# Altium project HW_ADHERENT_LANECTRL_R1.PrjPcb (part 1 of 2)
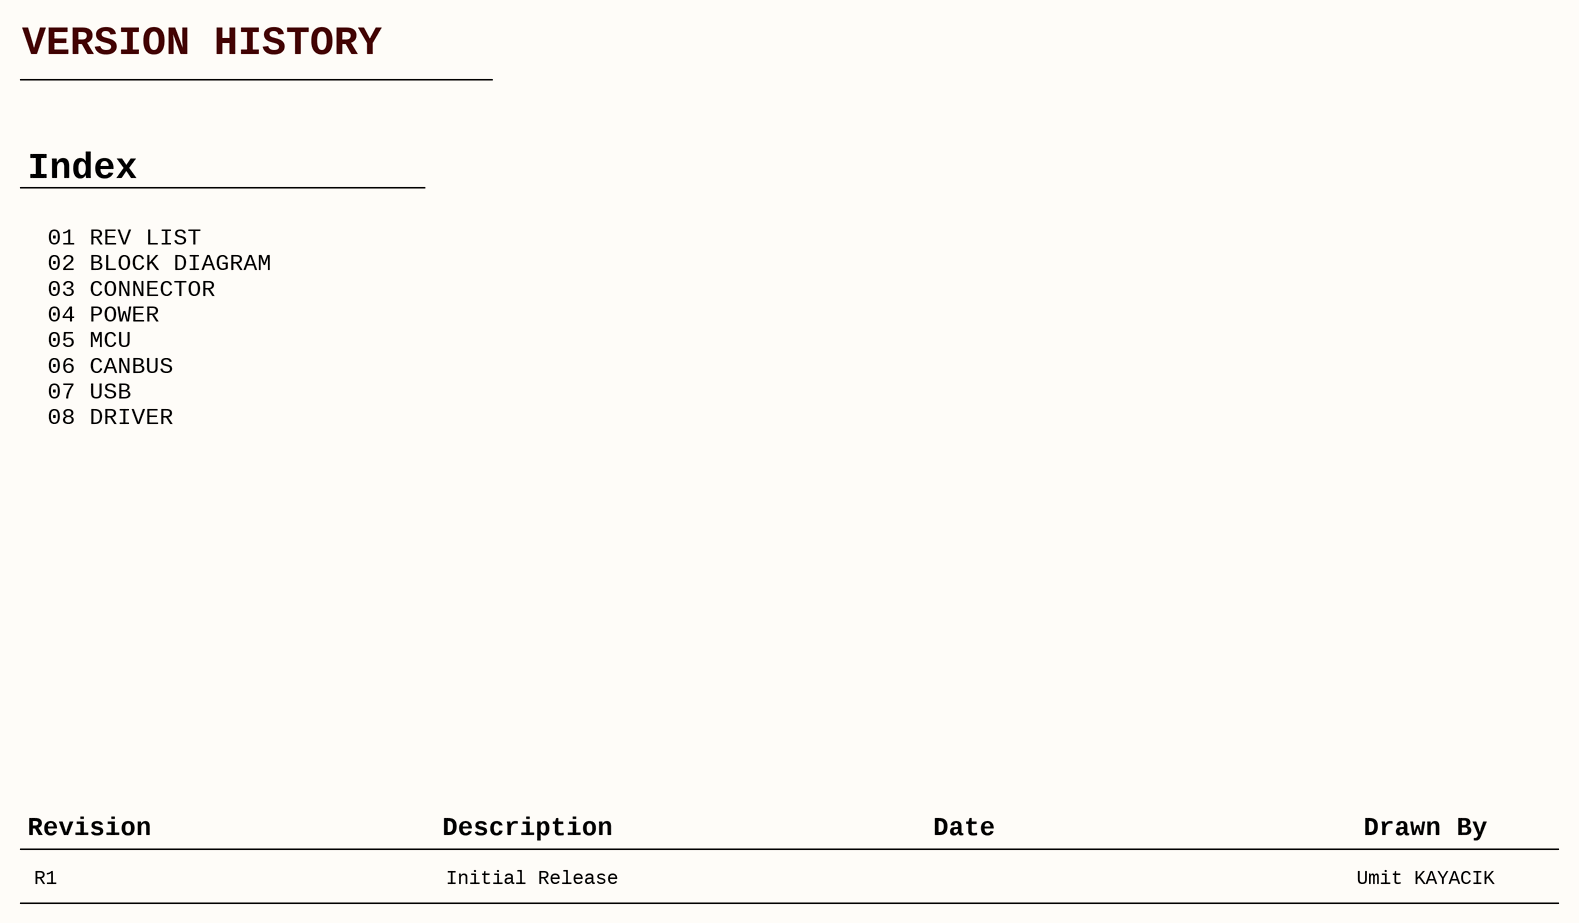
[diagram p0: 01_REVISION_HISTORY.SchDoc]
=Date: 23.09.2026; RevisionParameter: R1; TitleParameter: HW_ADHERENT_LANECTRL_R1
8 sheets, 223 parts. Net scope: flat (ports and power ports of the same name join across sheets).
Board file: HW_ADHERENT_LANECTRL_R1.PcbDoc
Sheets:
  01_REVISION_HISTORY.SchDoc
  02_BLOCK_DIAGRAM.SchDoc
  03_CONNECTOR.SchDoc
  04_POWER.SchDoc
  05_MCU.SchDoc
  06_CANBUS.SchDoc
  07_USB.SchDoc
  08_DRIVER.SchDoc

## Sheet 01_REVISION_HISTORY.SchDoc: =TitleParameter
size A3; Organization: ASISGUARD; Address1: Kemalpasa, Kemalpasa Cd. No:290 D:292H, 35060 Bornova/Izmir/Turkey; Revision: R1; SheetNumber: 1; SheetTotal: 8

### Notes on the sheet
- VERSION HISTORY
- Index
- 01 REV LIST
  02 BLOCK DIAGRAM
  03 CONNECTOR
  04 POWER
  05 MCU
  06 CANBUS
  07 USB
  08 DRIVER
- Revision
- Description
- Date
- Drawn By
- R1
- Initial Release
- Umit KAYACIK
- Proje/Project:
- Sayfa Adı/Document Name:
- Çizilme Tarihi/Drawing Date
- Tasarlayan/Designed By
- Sayfa/Sheet:
- Revision:
- of
- Son Güncelleme/Last Edit Date
- Kontrol eden/Checked By
- Onaylayan/Approved By
- Boyut/Size:
- Varyant/Variant:
- Dil/Language:
- A3
- ENG

## Sheet 02_BLOCK_DIAGRAM.SchDoc: =TitleParameter
size A3; Organization: ASISGUARD; Address1: Kemalpasa, Kemalpasa Cd. No:290 D:292H, 35060 Bornova/Izmir/Turkey; Revision: R1; SheetNumber: 2; SheetTotal: 8

### Notes on the sheet
- Proje/Project:
- Sayfa Adı/Document Name:
- Çizilme Tarihi/Drawing Date
- Umit KAYACIK
- Tasarlayan/Designed By
- Sayfa/Sheet:
- Revision:
- of
- Son Güncelleme/Last Edit Date
- Kontrol eden/Checked By
- Onaylayan/Approved By
- Boyut/Size:
- Varyant/Variant:
- Dil/Language:
- A3
- ENG
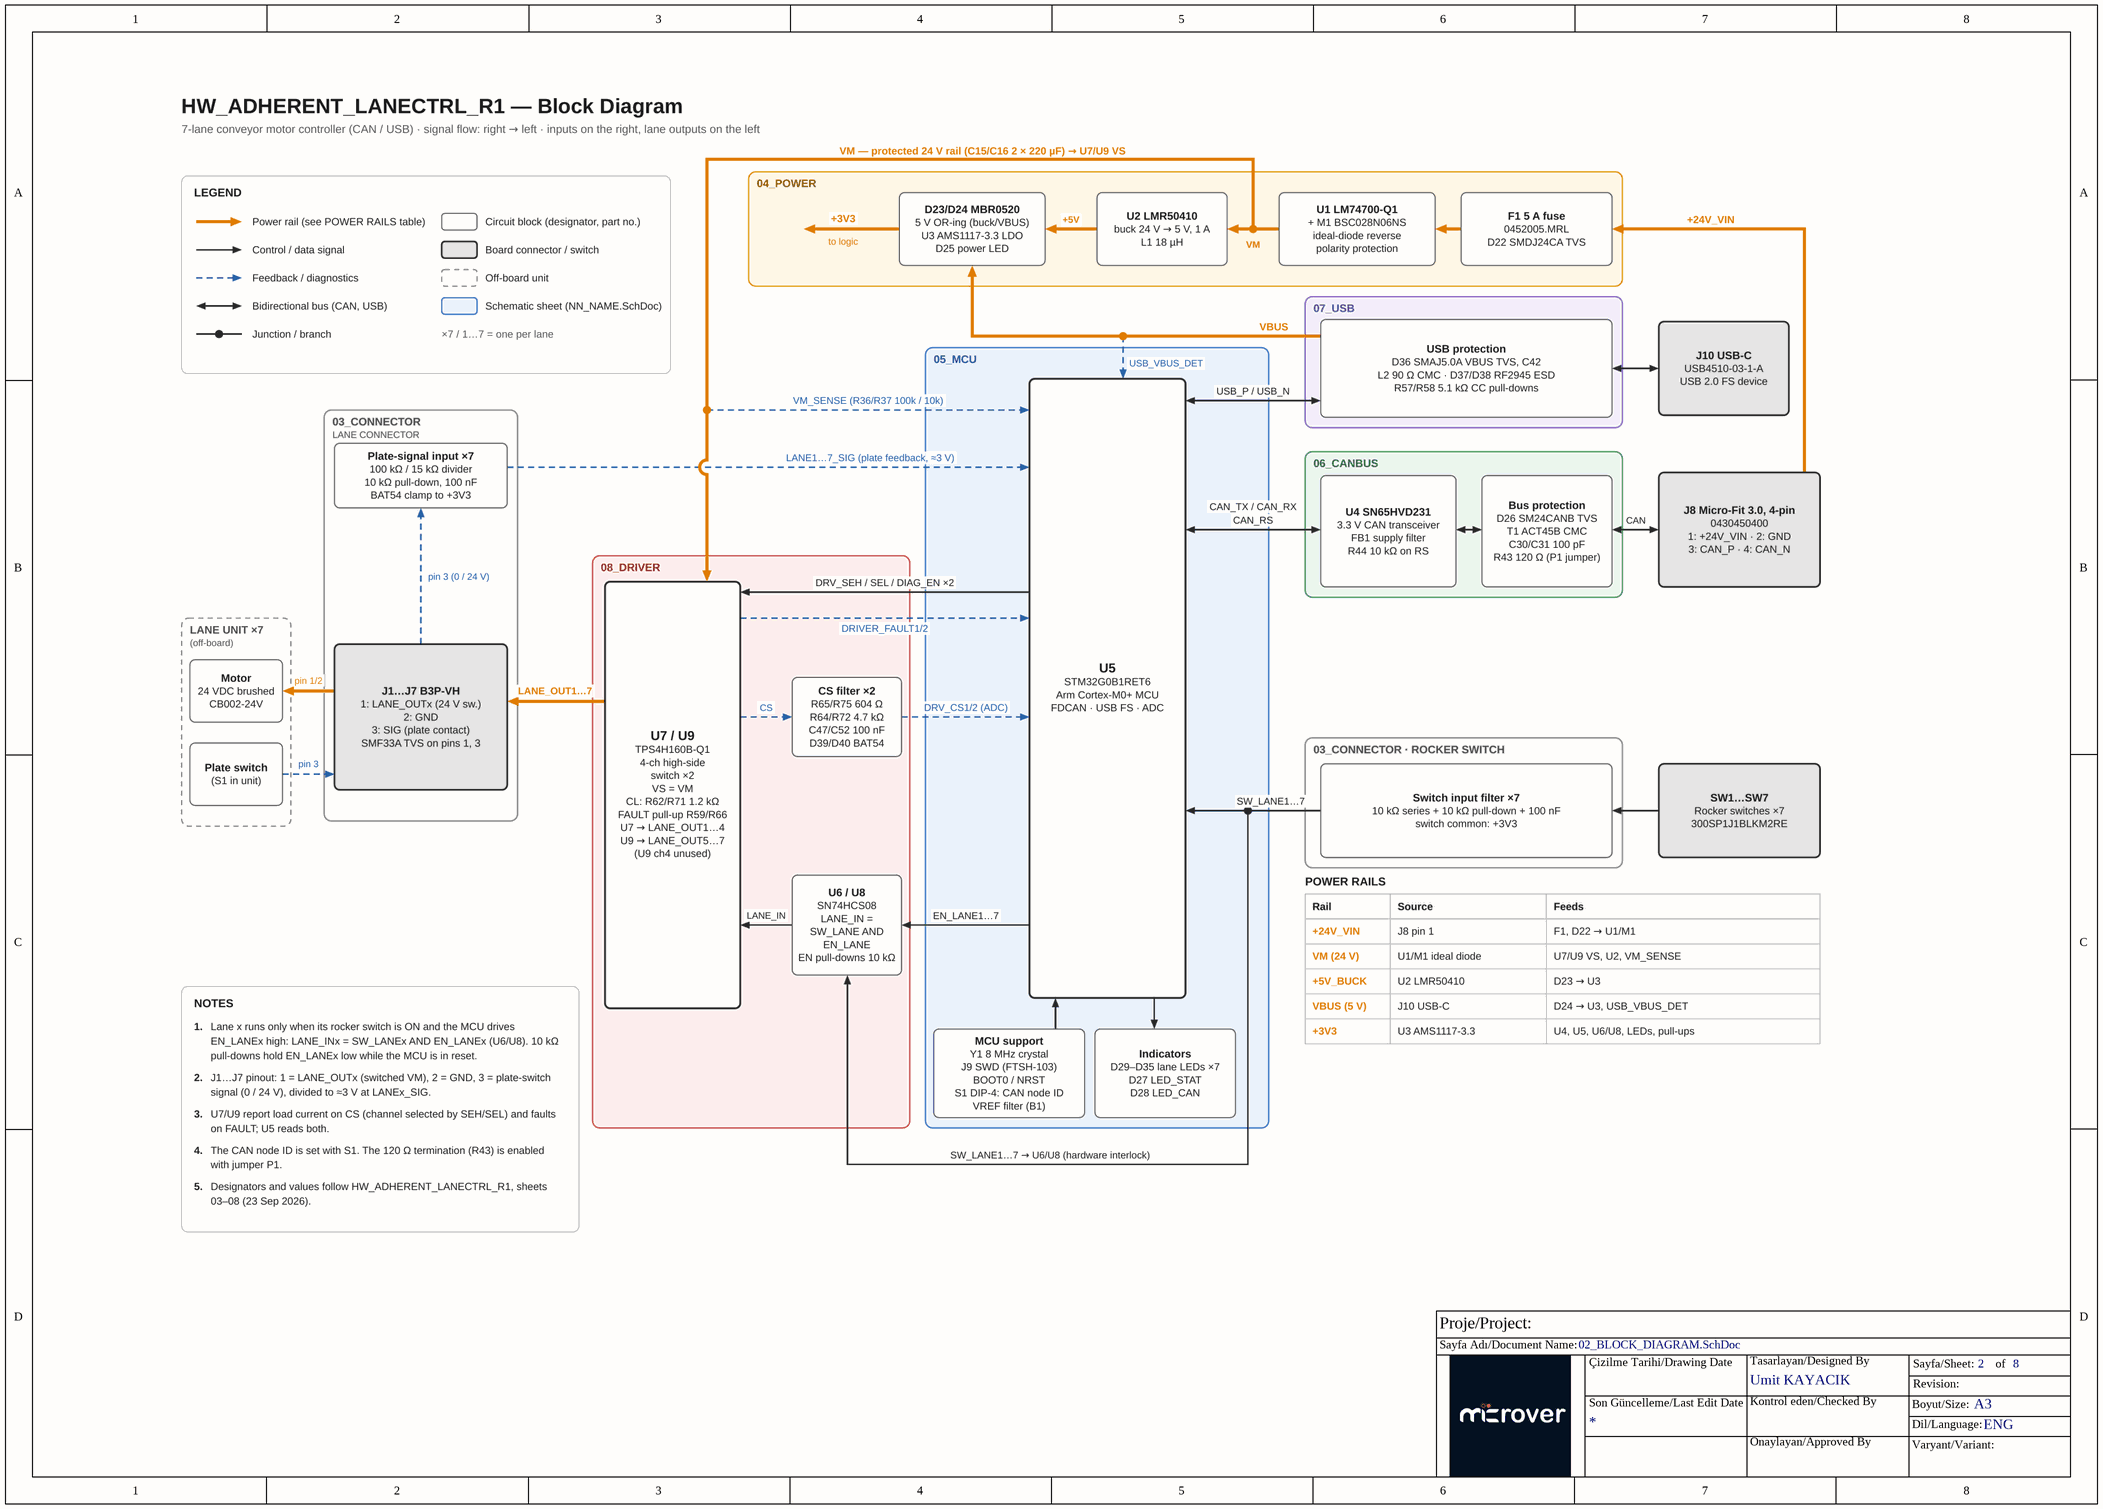
[diagram p1: 02_BLOCK_DIAGRAM.SchDoc]

## Sheet 03_CONNECTOR.SchDoc: =TitleParameter
size A3; Organization: ASISGUARD; Address1: Kemalpasa, Kemalpasa Cd. No:290 D:292H, 35060 Bornova/Izmir/Turkey; Revision: R1; SheetNumber: 3; SheetTotal: 8
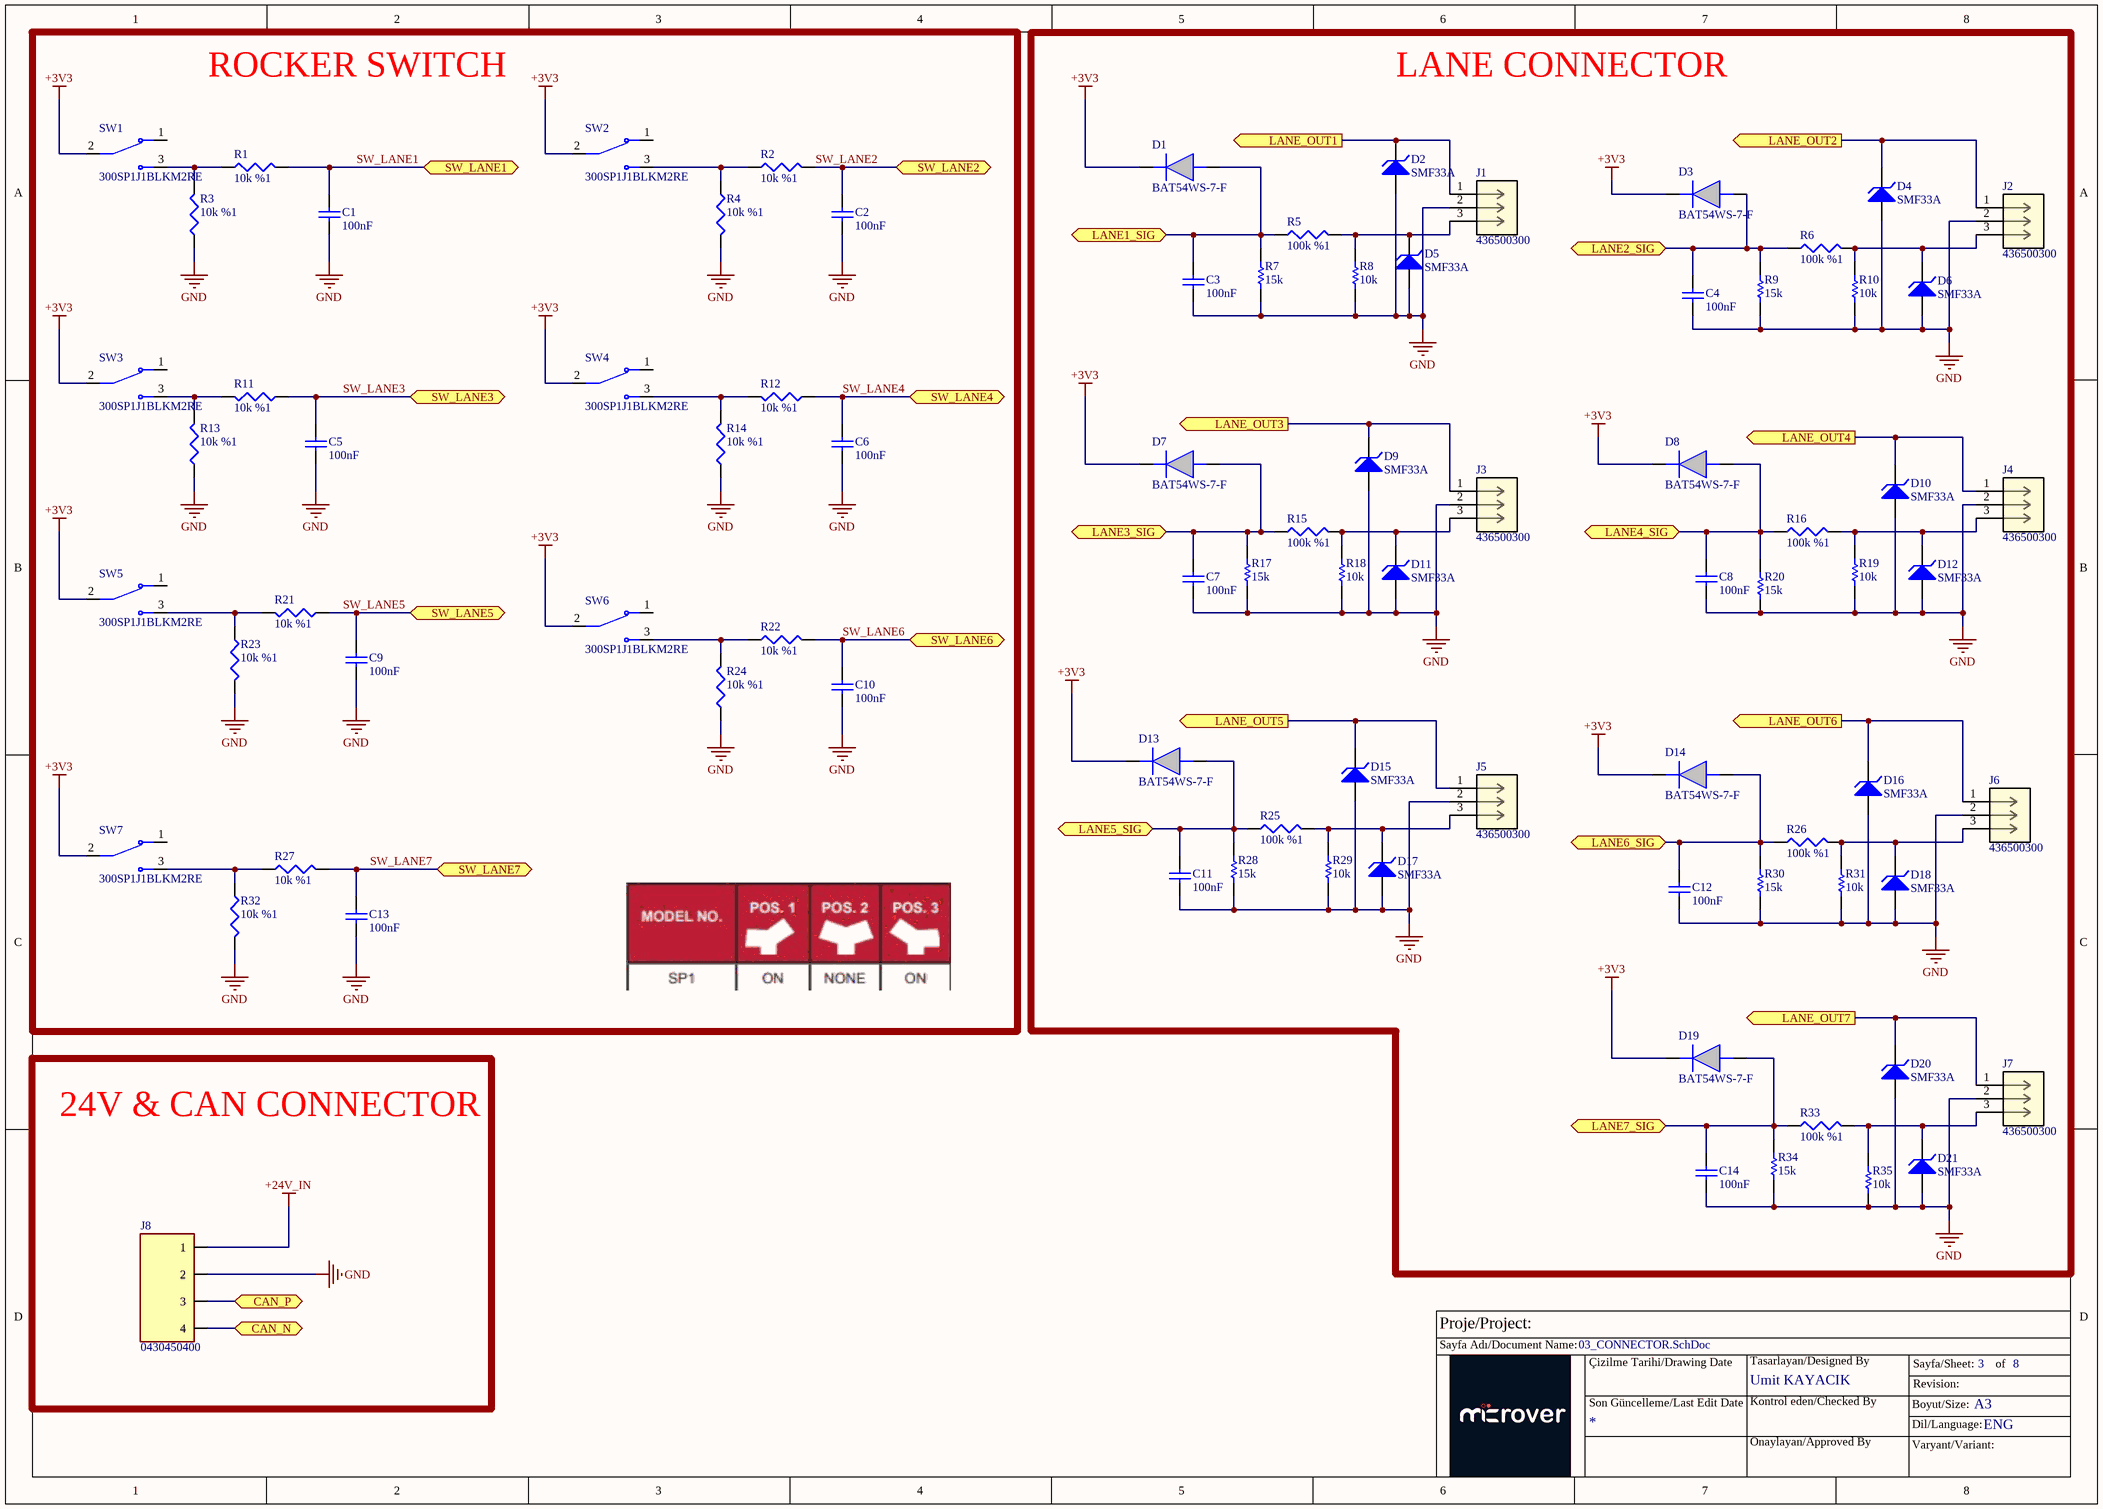
[diagram p2: 03_CONNECTOR.SchDoc]

### Parts
C1  100nF  [CAP0603]
C2  100nF  [CAP0603]
C3  100nF  [CAP0603]
C4  100nF  [CAP0603]
C5  100nF  [CAP0603]
C6  100nF  [CAP0603]
C7  100nF  [CAP0603]
C8  100nF  [CAP0603]
C9  100nF  [CAP0603]
C10  100nF  [CAP0603]
C11  100nF  [CAP0603]
C12  100nF  [CAP0603]
C13  100nF  [CAP0603]
C14  100nF  [CAP0603]
D1  BAT54WS-7-F  [SOD2513X120N]
D2  SMF33A  [SOD-123F - duplicate]
D3  BAT54WS-7-F  [SOD2513X120N]
D4  SMF33A  [SOD-123F - duplicate]
D5  SMF33A  [SOD-123F - duplicate]
D6  SMF33A  [SOD-123F - duplicate]
D7  BAT54WS-7-F  [SOD2513X120N]
D8  BAT54WS-7-F  [SOD2513X120N]
D9  SMF33A  [SOD-123F - duplicate]
D10  SMF33A  [SOD-123F - duplicate]
D11  SMF33A  [SOD-123F - duplicate]
D12  SMF33A  [SOD-123F - duplicate]
D13  BAT54WS-7-F  [SOD2513X120N]
D14  BAT54WS-7-F  [SOD2513X120N]
D15  SMF33A  [SOD-123F - duplicate]
D16  SMF33A  [SOD-123F - duplicate]
D17  SMF33A  [SOD-123F - duplicate]
D18  SMF33A  [SOD-123F - duplicate]
D19  BAT54WS-7-F  [SOD2513X120N]
D20  SMF33A  [SOD-123F - duplicate]
D21  SMF33A  [SOD-123F - duplicate]
J1  436500300  [CONN_SD-43650-001_03_MOL/]
J2  436500300  [CONN_SD-43650-001_03_MOL/]
J3  436500300  [CONN_SD-43650-001_03_MOL/]
J4  436500300  [CONN_SD-43650-001_03_MOL/]
J5  436500300  [CONN_SD-43650-001_03_MOL/]
J6  436500300  [CONN_SD-43650-001_03_MOL/]
J7  436500300  [CONN_SD-43650-001_03_MOL/]
J8  0430450400  [CONN_SD-43045-001_04_MOL]
R1  10k %1  [RESIS_0603]
R2  10k %1  [RESIS_0603]
R3  10k %1  [RESIS_0603]
R4  10k %1  [RESIS_0603]
R5  100k %1  [RESIS_0603]
R6  100k %1  [RESIS_0603]
R7  15k  [RESIS_0603]
R8  10k  [RES0805]
R9  15k  [RESIS_0603]
R10  10k  [RES0805]
R11  10k %1  [RESIS_0603]
R12  10k %1  [RESIS_0603]
R13  10k %1  [RESIS_0603]
R14  10k %1  [RESIS_0603]
R15  100k %1  [RESIS_0603]
R16  100k %1  [RESIS_0603]
R17  15k  [RESIS_0603]
R18  10k  [RES0805]
R19  10k  [RES0805]
R20  15k  [RESIS_0603]
R21  10k %1  [RESIS_0603]
R22  10k %1  [RESIS_0603]
R23  10k %1  [RESIS_0603]
R24  10k %1  [RESIS_0603]
R25  100k %1  [RESIS_0603]
R26  100k %1  [RESIS_0603]
R27  10k %1  [RESIS_0603]
R28  15k  [RESIS_0603]
R29  10k  [RES0805]
R30  15k  [RESIS_0603]
R31  10k  [RES0805]
R32  10k %1  [RESIS_0603]
R33  100k %1  [RESIS_0603]
R34  15k  [RESIS_0603]
R35  10k  [RES0805]
SW1  300SP1J1BLKM2RE  [sw_300SP1J1BLKM2RE_]
SW2  300SP1J1BLKM2RE  [sw_300SP1J1BLKM2RE_]
SW3  300SP1J1BLKM2RE  [sw_300SP1J1BLKM2RE_]
SW4  300SP1J1BLKM2RE  [sw_300SP1J1BLKM2RE_]
SW5  300SP1J1BLKM2RE  [sw_300SP1J1BLKM2RE_]
SW6  300SP1J1BLKM2RE  [sw_300SP1J1BLKM2RE_]
SW7  300SP1J1BLKM2RE  [sw_300SP1J1BLKM2RE_]

### Blocks framed on the sheet
ROCKER SWITCH: C1 C2 C5 C6 C9 C10 C13 R1-R4 R11-R14 R21-R24 R27 R32 SW1-SW7
LANE CONNECTOR: C3 C4 C7 C8 C11 C12 C14 D1-D21 J1-J7 R5-R10 R15-R20 R25 R26 R28-R31 R33-R35
24V & CAN CONNECTOR: J8

### Ports
CAN_N (bidir), CAN_P (bidir), LANE1_SIG (bidir), LANE2_SIG (bidir), LANE3_SIG (bidir), LANE4_SIG (bidir), LANE5_SIG (bidir), LANE6_SIG (bidir), LANE7_SIG (bidir), LANE_OUT1 (out), LANE_OUT2 (out), LANE_OUT3 (out), LANE_OUT4 (out), LANE_OUT5 (out), LANE_OUT6 (out), LANE_OUT7 (out), SW_LANE1 (bidir), SW_LANE2 (bidir), SW_LANE3 (bidir), SW_LANE4 (bidir), SW_LANE5 (bidir), SW_LANE6 (bidir), SW_LANE7 (bidir)

### Nets
+3V3: D1.1(K) D3.1(K) D7.1(K) D8.1(K) D13.1(K) D14.1(K) D19.1(K) SW1.2 SW2.2 SW3.2 SW4.2 SW5.2 SW6.2 SW7.2
+24V_IN: J8.1  [project net +24V_VIN]
GND: C1.1 C2.1 C3.1 C4.1 C5.1 C6.1 C7.1 C8.1 C9.1 C10.1 C11.1 C12.1 C13.1 C14.1 D2.2(A) D4.2(A) D5.2(A) D6.2(A) D9.2(A) D10.2(A) D11.2(A) D12.2(A) D15.2(A) D16.2(A) D17.2(A) D18.2(A) D20.2(A) D21.2(A) J1.2 J2.2 J3.2 J4.2 J5.2 J6.2 J7.2 J8.2 R3.1 R4.2 R7.1 R8.1 R9.1 R10.1 R13.1 R14.1 R17.1 R18.1 R19.1 R20.1 R23.2 R24.1 R28.1 R29.1 R30.1 R31.1 R32.2 R34.1 R35.1
CAN_N: J8.4 ; port CAN_N
CAN_P: J8.3 ; port CAN_P
LANE1_SIG: C3.2 D1.2(A) R5.1 R7.2 ; port LANE1_SIG
LANE2_SIG: C4.2 D3.2(A) R6.1 R9.2 ; port LANE2_SIG
LANE3_SIG: C7.2 D7.2(A) R15.1 R17.2 ; port LANE3_SIG
LANE4_SIG: C8.2 D8.2(A) R16.1 R20.2 ; port LANE4_SIG
LANE5_SIG: C11.2 D13.2(A) R25.1 R28.2 ; port LANE5_SIG
LANE6_SIG: C12.2 D14.2(A) R26.1 R30.2 ; port LANE6_SIG
LANE7_SIG: C14.2 D19.2(A) R33.1 R34.2 ; port LANE7_SIG
LANE_OUT1: D2.1(K) J1.1 ; port LANE_OUT1
LANE_OUT2: D4.1(K) J2.1 ; port LANE_OUT2
LANE_OUT3: D9.1(K) J3.1 ; port LANE_OUT3
LANE_OUT4: D10.1(K) J4.1 ; port LANE_OUT4
LANE_OUT5: D15.1(K) J5.1 ; port LANE_OUT5
LANE_OUT6: D16.1(K) J6.1 ; port LANE_OUT6
LANE_OUT7: D20.1(K) J7.1 ; port LANE_OUT7
SW_LANE1: C1.2 R1.2 ; port SW_LANE1
SW_LANE2: C2.2 R2.2 ; port SW_LANE2
SW_LANE3: C5.2 R11.1 ; port SW_LANE3
SW_LANE4: C6.2 R12.1 ; port SW_LANE4
SW_LANE5: C9.2 R21.1 ; port SW_LANE5
SW_LANE6: C10.2 R22.2 ; port SW_LANE6
SW_LANE7: C13.2 R27.2 ; port SW_LANE7
NetD5_1: D5.1(K) J1.3 R5.2 R8.2
NetD6_1: D6.1(K) J2.3 R6.2 R10.2
NetD11_1: D11.1(K) J3.3 R15.2 R18.2
NetD12_1: D12.1(K) J4.3 R16.2 R19.2
NetD17_1: D17.1(K) J5.3 R25.2 R29.2
NetD18_1: D18.1(K) J6.3 R26.2 R31.2
NetD21_1: D21.1(K) J7.3 R33.2 R35.2
NetR1_1: R1.1 R3.2 SW1.3
NetR2_1: R2.1 R4.1 SW2.3
NetR11_2: R11.2 R13.2 SW3.3
NetR12_2: R12.2 R14.2 SW4.3
NetR21_2: R21.2 R23.1 SW5.3
NetR22_1: R22.1 R24.2 SW6.3
NetR27_1: R27.1 R32.1 SW7.3

Not connected (* = marked no-connect by the designer): SW1 1; SW2 1; SW3 1; SW4 1; SW5 1; SW6 1; SW7 1

### Notes on the sheet
- Proje/Project:
- Sayfa Adı/Document Name:
- Çizilme Tarihi/Drawing Date
- Umit KAYACIK
- Tasarlayan/Designed By
- Sayfa/Sheet:
- Revision:
- of
- Son Güncelleme/Last Edit Date
- Kontrol eden/Checked By
- Onaylayan/Approved By
- Boyut/Size:
- Varyant/Variant:
- Dil/Language:
- A3
- ENG

### Library data of the parts
C1-C14 = CAP0603_100nF_50V: 0.1 µF ±10% 50V Ceramic Capacitor X7R 0603 (1608 Metric); Manufacturer Name: KEMET; Manufacturer Part Number: C0603C104K5RAC7867; Datasheet Link: https://componentsearchengine.com/Datasheets/1/06031A100FAT2A.pdf; Height: 0.9mm
D1 D3 D7 D8 D13 D14 D19 = BAT54WS-7-F: Diode 30 V 100mA Surface Mount SOD-323; MPN: BAT54WS-7-F; Supplier: C124205
D2 D4-D6 D9-D12 D15-D18 D20 D21 = SMF33A: 53.3V Clamp 3.8A Ipp Tvs Diode Surface Mount SOD-123F; Manufacturer: Littelfuse Inc.; MPN: SMF33A
J1-J7 = 436500300: Micro-Fit 3.0 Right-Angle Header, 3.00mm Pitch, Single Row, 3 Circuits, with Snap-in Plastic Peg PCB Lock, Tin, Glow-Wire Capable, Black; Manufacturer Part Number: 436500300; Supplier: Digi; WM1861-ND
J8 = 0430450400: Connector Header Through Hole, Right Angle 4 position 0.118" (3.00mm); Manufacturer: MOLEX; Manufacturer Part Number: 0430450400; Supplier: Digi; WM1814-ND
R1-R4 R11-R14 R21-R24 R27 R32 = 0603WAF1002T5E: Thick Film Resistors - SMD 0603 100 mW (1/10 W) 1% 10K; Manufacturer: UNI-ROYAL(Uniroyal Elec); Supplier_JLCPCB: C25804; Supplier_MOUSER: 303-0603WAF1002T5E
R5 R6 R15 R16 R25 R26 R33 = 0603WAF1003T5E: -55℃~+155℃ 100kΩ 100mW 75V Thick Film Resistor ±1% ±100ppm/℃ 0603 Chip Resistor - Surface Mount ROHS; Manufacturer: UNI-ROYAL(Uniroyal Elec); Supplier_JLCPCB: C25803; Supplier_MOUSER: 303-0603WAF1003T5E
R7 R9 R17 R20 R28 R30 R34 = 0603WAF1502T5E: -55℃~+155℃ 100mW 15kΩ 75V Thick Film Resistor ±1% ±100ppm/℃ 0603 Chip Resistor - Surface Mount ROHS; Manufacturer: UNI-ROYAL(Uniroyal Elec); JLCPCB PART 3: C22809; Mouser Part Number: 303-0603WAF1502T5E
R8 R10 R18 R19 R29 R31 R35 = 0805W8F1002T5E: -55℃~+155℃ 10kΩ 125mW 150V Thick Film Resistor ±1% ±100ppm/℃ 0805 Chip Resistor - Surface Mount ROHS; Manufacturer: UNI-ROYAL(Uniroyal Elec); JLCPCB PART#: C17414
SW1-SW7 = 300SP1J1BLKM2RE: Rocker Switch SPDT 0.4VA (AC/DC) 20 V Through Hole; Manufacturer: E-Switch; MPN: 300SP1J1BLKM2RE; Supplier: Dıgı; EG4312-ND

## Sheet 04_POWER.SchDoc: =TitleParameter
size A3; Project: HW_RYP_RADAR_R3; Organization: ASISGUARD; Address1: Kemalpasa, Kemalpasa Cd. No:290 D:292H, 35060 Bornova/Izmir/Turkey; Revision: R1; SheetNumber: 4; SheetTotal: 8
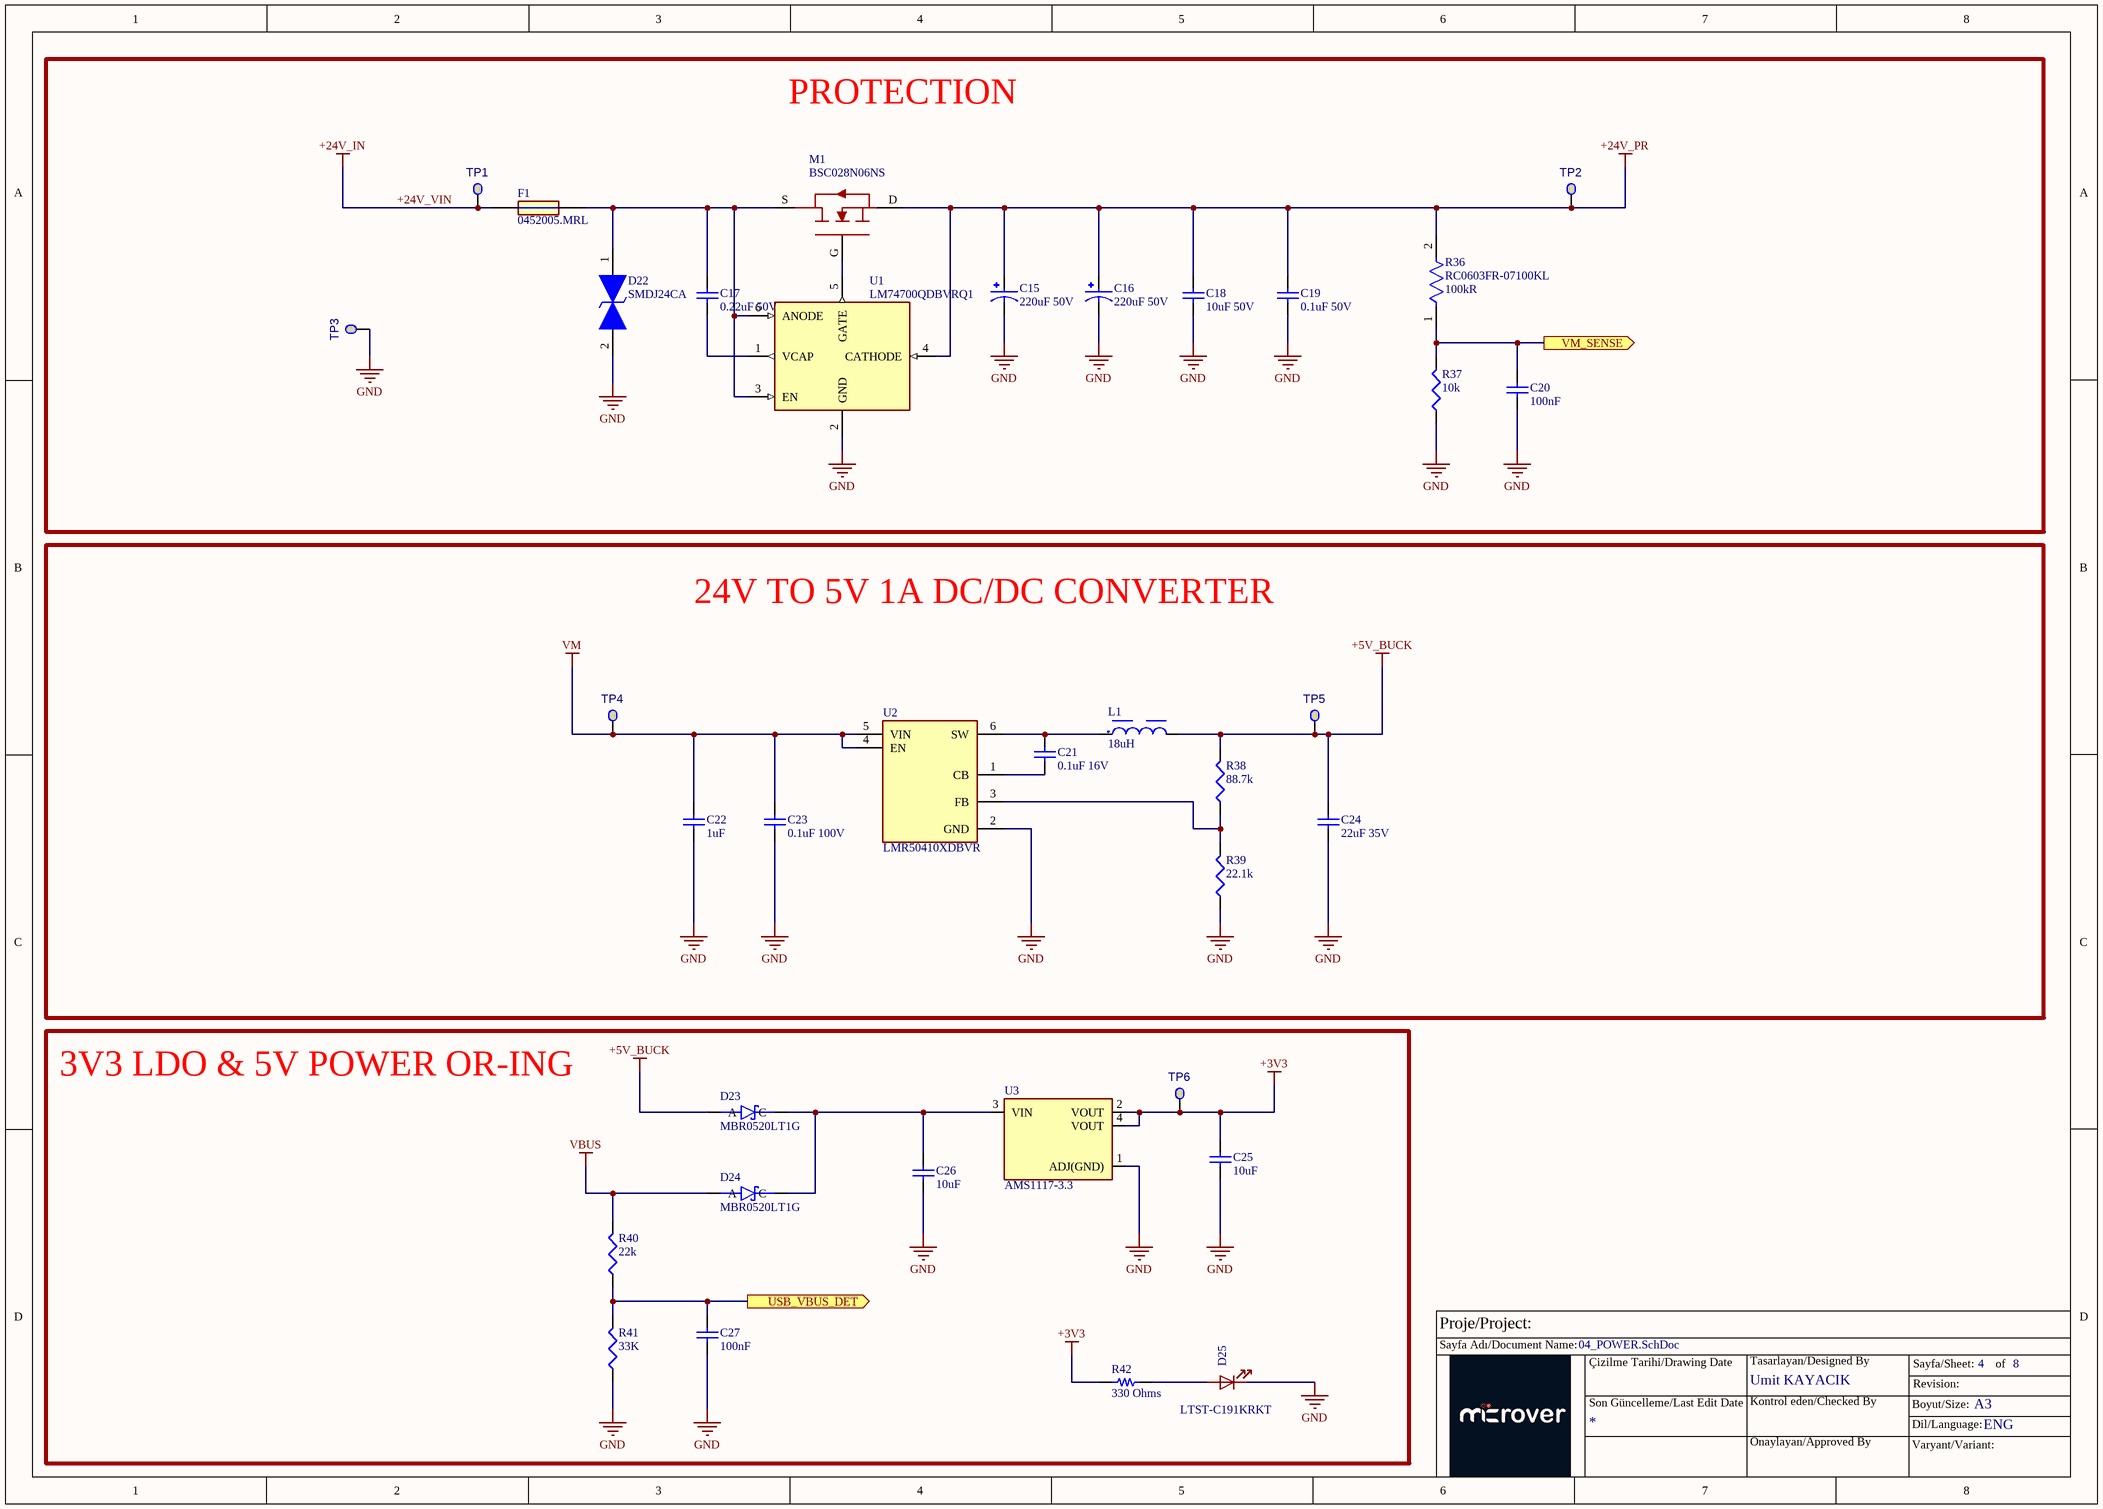
[diagram p3: 04_POWER.SchDoc]

### Parts
C15  220uF 50V  [CAP_EEEFT1H221AV]
C16  220uF 50V  [CAP_EEEFT1H221AV]
C17  value 0.22uF 50V  [SMC0603]  (hidden comment: CAP CER 0.22UF 50V X7R 0603)
C18  value 10uF 50V  [SMC1206]  (hidden comment: CAP CER 10UF 50V X5R 1206)
C19  value 0.1uF 50V  [SMC0603]  (hidden comment: CAP CER 0.1UF 50V X7R 0603)
C20  value 100nF  [CAP0603]  (hidden comment: 100nF 25V)
C21  0.1uF 16V  [CAP0603]
C22  1uF  [CAP0603]
C23  0.1uF 100V  [CAP0603]
C24  22uF 35V  [CAP1206]
C25  10uF  [CAP0603]
C26  10uF  [CAP0603]
C27  value 100nF  [CAP0603]  (hidden comment: 100nF 25V)
D22  SMDJ24CA  [DIONM9059X262N]
D23  MBR0520LT1G  [SOD3716X135N]
D24  MBR0520LT1G  [SOD3716X135N]
D25  LTST-C191KRKT  [LED0603]
F1  0452005.MRL  [FUSC6127X294N]
L1  18uH  [WE-LQS_6045]
M1  BSC028N06NS  [BSC028N06NS]
R36  RC0603FR-07100KL  Resistance: 100kR  [FP-RC0603-0_55-MFG]
R37  value 10k  [RES0603]  (hidden comment: RES 10K OHM 1% 1/8W 0603)
R38  88.7k  [RES0603]
R39  22.1k  [RES0603]
R40  value 22k  [SMR0603]  (hidden comment: RES 22K OHM 1% 1/10W 0603)
R41  value 33K  [SMR0603]  (hidden comment: RES 33K OHM 1% 1/10W 0603)
R42  330 Ohms  [RES 0603_1608]
TP1  Testpoint  [SMD_Ø1.5mm]  (value not drawn)  (no BOM)
TP2  Testpoint  [SMD_Ø1.5mm]  (value not drawn)  (no BOM)
TP3  Testpoint  [SMD_Ø1.5mm]  (value not drawn)  (no BOM)
TP4  Testpoint  [SMD_Ø1.5mm]  (value not drawn)  (no BOM)
TP5  Testpoint  [SMD_Ø1.5mm]  (value not drawn)  (no BOM)
TP6  Testpoint  [SMD_Ø1.5mm]  (value not drawn)  (no BOM)
U1  LM74700QDBVRQ1  [SOT95P280X145-6N/LM74700QDBVRQ1]
U2  LMR50410XDBVR  [SOT95P280X145-6N/]
U3  AMS1117-3.3  [SOT-223-4_L6.5-W3.5-P2.30-LS7.0-BR]

### Blocks framed on the sheet
PROTECTION: C15-C20 D22 F1 M1 R36 R37 TP1-TP3 U1
24V TO 5V 1A DC/DC CONVERTER: C21-C24 L1 R38 R39 TP4 TP5 U2
3V3 LDO & 5V POWER OR-ING: C25-C27 D23-D25 R40-R42 TP6 U3

### Ports
USB_VBUS_DET (out), VM_SENSE (out)

### Nets
+3V3: C25.2 R42.1 TP6.1(P1) U3.2(VOUT) U3.4(VOUT)
+5V_BUCK: C24.2 D23.A L1.2 R38.2 TP5.1(P1)
+24V_PR: C15.1 C16.1 C18.2 C19.2 M1.D R36.2 TP2.1(P1) U1.4(CATHODE)
+24V_VIN: F1.1 TP1.1(P1)  [also labelled +24V_IN]
GND: C15.2 C16.2 C18.1 C19.1 C20.1 C22.1 C23.1 C24.1 C25.1 C26.1 C27.1 D22.2 D25.2(K) R37.1 R39.1 R41.1 TP3.1(P1) U1.2(GND) U2.2(GND) U3.1(ADJ(GND))
VBUS: D24.A R40.2
VM: C22.2 C23.2 TP4.1(P1) U2.4(EN) U2.5(VIN)
USB_VBUS_DET: C27.2 R40.1 R41.2 ; port USB_VBUS_DET
VM_SENSE: C20.2 R36.1 R37.2 ; port VM_SENSE
NetC17_1: C17.1 U1.1(VCAP)
NetC17_2: C17.2 D22.1 F1.2 M1.S U1.3(EN) U1.6(ANODE)
NetC21_1: C21.1 U2.1(CB)
NetC21_2: C21.2 L1.1 U2.6(SW)
NetC26_2: C26.2 D23.C D24.C U3.3(VIN)
NetD25_1: D25.1(A) R42.2
NetM1_G: M1.G U1.5(GATE)
NetR38_1: R38.1 R39.2 U2.3(FB)

### Notes on the sheet
- Proje/Project:
- Sayfa Adı/Document Name:
- Çizilme Tarihi/Drawing Date
- Umit KAYACIK
- Tasarlayan/Designed By
- Sayfa/Sheet:
- Revision:
- of
- Son Güncelleme/Last Edit Date
- Kontrol eden/Checked By
- Onaylayan/Approved By
- Boyut/Size:
- Varyant/Variant:
- Dil/Language:
- A3
- ENG

### Library data of the parts
C15 C16 = EEEFT1H221AV: 220 µF 50 V Aluminum Electrolytic Capacitors Radial, Can - SMD 180mOhm @ 100kHz 2000 Hrs @ 105°C; Manufacturer Part Number: EEE-FT1H221AV; MF: Panasonic Electronic Components; Package: RADIAL-2 Panasonic; Price: None; Availability: In Stock; Value: *; Check_prices: https://www.snapeda.com/parts/EEE-FT1H221AV/Panasonic/view-part/5517810/?ref=eda; SnapEDA_Link: https://www.snapeda.com/parts/EEE-FT1H221AV/Panasonic/view-part/5517810/?ref=snap
C17 = CAP0603_0.22UF_50V: 0.22 µF ±10% 50V Ceramic Capacitor X7R 0603 (1608 Metric); Manufacturer Part Number: GCM188R71H224KA64D; Order Code: DIGI: 490-5402-2-ND
C18 = CAP1206_10UF_50V: 10 µF ±10% 50V Ceramic Capacitor X5R 1206 (3216 Metric); Manufacturer Part Number: CL31A106KBHNNNE; Order Code: Digi: 1276-2876-2-ND; Sirius Stock Code: *; LCSC Part Number: C13585; LCSC Manufacturer Part Number: CL31A106KBHNNNE
C19 = CAP0603_0.1UF_50V_2: 0.1 µF ±10% 50V Ceramic Capacitor X7R 0603 (1608 Metric); Manufacturer Part Number: CL10B104KB8NNNL; LCSC Manufacturer Part Number: CL10B104KB8NNNC; Order Code: DIGI:1276-CL10B104KB8NNNLTR-ND; Sirius Stock Code: A063-AGC10300001226; LCSC Part Number: C1591
C20 C27 = CAP0603_100nF: 0.1 µF ±10% 50V Ceramic Capacitor X7R 0603 (1608 Metric); Manufacturer Part Number: CL10B104KA8NNNC; LCSC Part Number: C1590
C21 = C0603C104M4RACTU: 0.1 µF ±20% 16V Ceramic Capacitor X7R 0603 (1608 Metric); Manifacturer: KEMET; Supplier: Digi; 399-C0603C104M4RACTUDKR-ND
C22 = MSASU168SB5105MTNA01: CAP CER 1UF 50V X5R 0603; Manufacturer: Taiyo Yuden; Supplier: 587-MSASU168SB5105MTNA01DKR-ND
C23 = GRM188R72A104KA35D: CAP CER 0.1UF 100V X7R 0603; Manifacturer: Murata Electronics; Supplier: Digi; 490-3285-6-ND
C24 = CAP1206_22uF_35V: 22 µF ±20% 35V Ceramic Capacitor X5R 1206 (3216 Metric); Manufacturer Part Number: C3216X5R1V226M160AC; Order Code: DIGI : 445-180362-1-ND; Value: 22uF 35V
C25 C26 = CAP0603_10uF_25V: 10 µF ±10% 25V Ceramic Capacitor X5R 0603 (1608 Metric); Manufacturer Part Number: GRM188R61E106KA73J; Order Code: Digi; 490-GRM188R61E106KA73JDKR-ND; Value: 10uF
D22 = SMDJ24CA: 38.9V Clamp 77.1A Ipp Tvs Diode Surface Mount DO-214AB (SMCJ); Manufacturer: Littelfuse Inc.; MPN: SMDJ24CA
D23 D24 = MBR0520LT1G: Diode 20 V 500mA Surface Mount SOD-123
D25 = LED_1: LED RED CLEAR SMD; Manufacturer: Lite-On Inc.; Value: LTST-C191KRKT; Footprint: LED_SMD:LED_0603_1608Metric; Manufacturer Part Number: LTST-C191KRKT; Supplier Part Number: 160-1447-1-ND
F1 = 0452005.MRL: FUSE BRD MNT 5A 125VAC/VDC 2SMD; Manufacturer: Littelfuse; Supplier: Digi; F2607DKR-ND
L1 = 74404064180: 18 µH Semi-Shielded Drum Core, Wirewound Inductor 2.2 A 81mOhm Nonstandard; Supplier: 732-5553-6-ND
M1 = BSC028N06NS: MOSFET'ler N-Ch 60V 100A TDSON-8 OptiMOS 3
R36 = CMP-2100-03662-2: RES SMD 100K OHM 1% 1/10W 0603; Voltage Rating (DC): 50V; Max Power Dissipation: 100mW; Temperature Coefficient: 100ppm/°C; Working Voltage: 75V; Length: 1.6mm; Lead Free: Lead Free; Number of Terminations: 2; Packaging: Tape and Reel; Voltage Rating: 50V; Termination: SMD/SMT; Width: 0.8mm; Resistor Type: Thick Film; Resistance Tolerance: 1%; Features: Moisture Resistant; Height: 0.45mm; Construction: Rectangular; Case/Package: 0603; Military Standard: Not; Case Code (Imperial): 0603; Series: RC; Technology: THICK FILM; Depth: 0.8mm; RoHS Compliant: Yes; REACH SVHC: No SVHC; Min Operating Temperature: -55°C; Case Code (Metric): 1608; Max Operating Temperature: 155°C; Power Rating: 100mW; Number of Pins: 2; Tolerance: 1%
R37 = RES0603_10K_%1_1: 10 kOhms ±1% 0.125W, 1/8W Chip Resistor 0603 (1608 Metric) Anti-Sulfur Thin Film; Manufacturer Part Number: RNCP0603FTD10K0; LCSC Manufacturer Part Number: MCT06030C1002FP500; Order Code: Digi: RNCP0603FTD10K0TR-ND; Sirius Stock Code: *; LCSC Part Number: C161803
R38 = CRCW060388K7FKEA: 88.7 kOhms ±1% 0.125W, 1/8W Chip Resistor 0603 (1608 Metric) Automotive AEC-Q200 Thick Film
R39 = RC0603FR-0722K1L: 22.1 kOhms ±1% 0.1W, 1/10W Chip Resistor 0603 (1608 Metric) Moisture Resistant Thick Film
R40 = RES0603_22K_%1: 10 kOhms ±1% 0.1W, 1/10W Chip Resistor 0603 (1608 Metric) Moisture Resistant Thick Film; Manufacturer Part Number: RC0603FR-0722KL; Order Code: Digi: 311-22.0KHRTR-ND; Sirius Stock Code: *; LCSC Part Number: C114065; LCSC Manufacturer Part Number: RC0603FR-0722KL
R41 = RES0603_33K_%1: 33 kOhms ±1% 0.1W, 1/10W Chip Resistor 0603 (1608 Metric) Moisture Resistant Thick Film; Manufacturer Part Number: RC0603FR-0733KL; Order Code: Digi: 311-33.0KHRTR-ND; Sirius Stock Code: *; LCSC Manufacturer Part Number: RC0603FR-0733KL; LCSC Part Number: C126359
R42 = CRGH0603F330R: RES SMD 330 OHM 1% 1/5W 0603; Manufacturer: TE Connectivity Passive Product; Power (Watts): 0.2W, 1/5W; Temperature Coefficient: ±100ppm/°C; Part Number: CRGH0603F330R; Value: 330 Ohms; ComponentLink1Description: Datasheet; ComponentLink1URL: https://www.te.com/commerce/DocumentDelivery/DDEController?Action=srchrtrv&DocNm=1773204-1&DocType=DS&DocLang=English; ComponentLink2Description: DigiKey Link; ComponentLink2URL: https://www.digikey.com/en/products/detail/te-connectivity-passive-product/CRGH0603F330R/5586961; Composition: Thick Film; Device Package: 0603 (1608 Metric); Height - Seated (Max): 0.022" (0.55mm); LastUpdated: 2/9/2024 8:43:33 PM; Lifecycle Status: Active; Minimum Order: 1; Number of Terminations: 2; Operating Temperature: -55°C ~ 155°C; Package / Case: 0603 (1608 Metric); Packaging: TapeAndReel; PartId: 5733; Part Status: Active; Price: 0.01; Resistance: 330 Ohms; Series: CRGH, Neohm; Size / Dimension: 0.063" L x 0.031" W (1.60mm x 0.80mm); Supplier 1: DigiKey; Supplier Part Number 1: A129541CT-ND; Supplier Device Package: 0603; Tolerance: ±1%
TP1-TP6 = TEST PAD SMT 10MIL X 20MIL: DNP: DNP; Value: Testpoint
U1 = LM74700QDBVRQ1: OR Controller N+1 ORing Controller N-Channel 1:1 SOT-23-6
U2 = LMR50410XDBVR: Buck Switching Regulator IC Positive Adjustable 1V 1 Output 1A SOT-23-6; Supplier: 296-LMR50410XDBVRDKR-ND; MPN: LMR50410XDBVR
U3 = AMS1117-3.3: Linear Voltage Regulator IC Positive Fixed 1 Output 1A SOT-223-3L; Manufacturer: UMW; Supplier: C347222

## Sheet 05_MCU.SchDoc: =TitleParameter
size A3; Organization: ASISGUARD; Address1: Kemalpasa, Kemalpasa Cd. No:290 D:292H, 35060 Bornova/Izmir/Turkey; Revision: R1; SheetNumber: 5; SheetTotal: 8
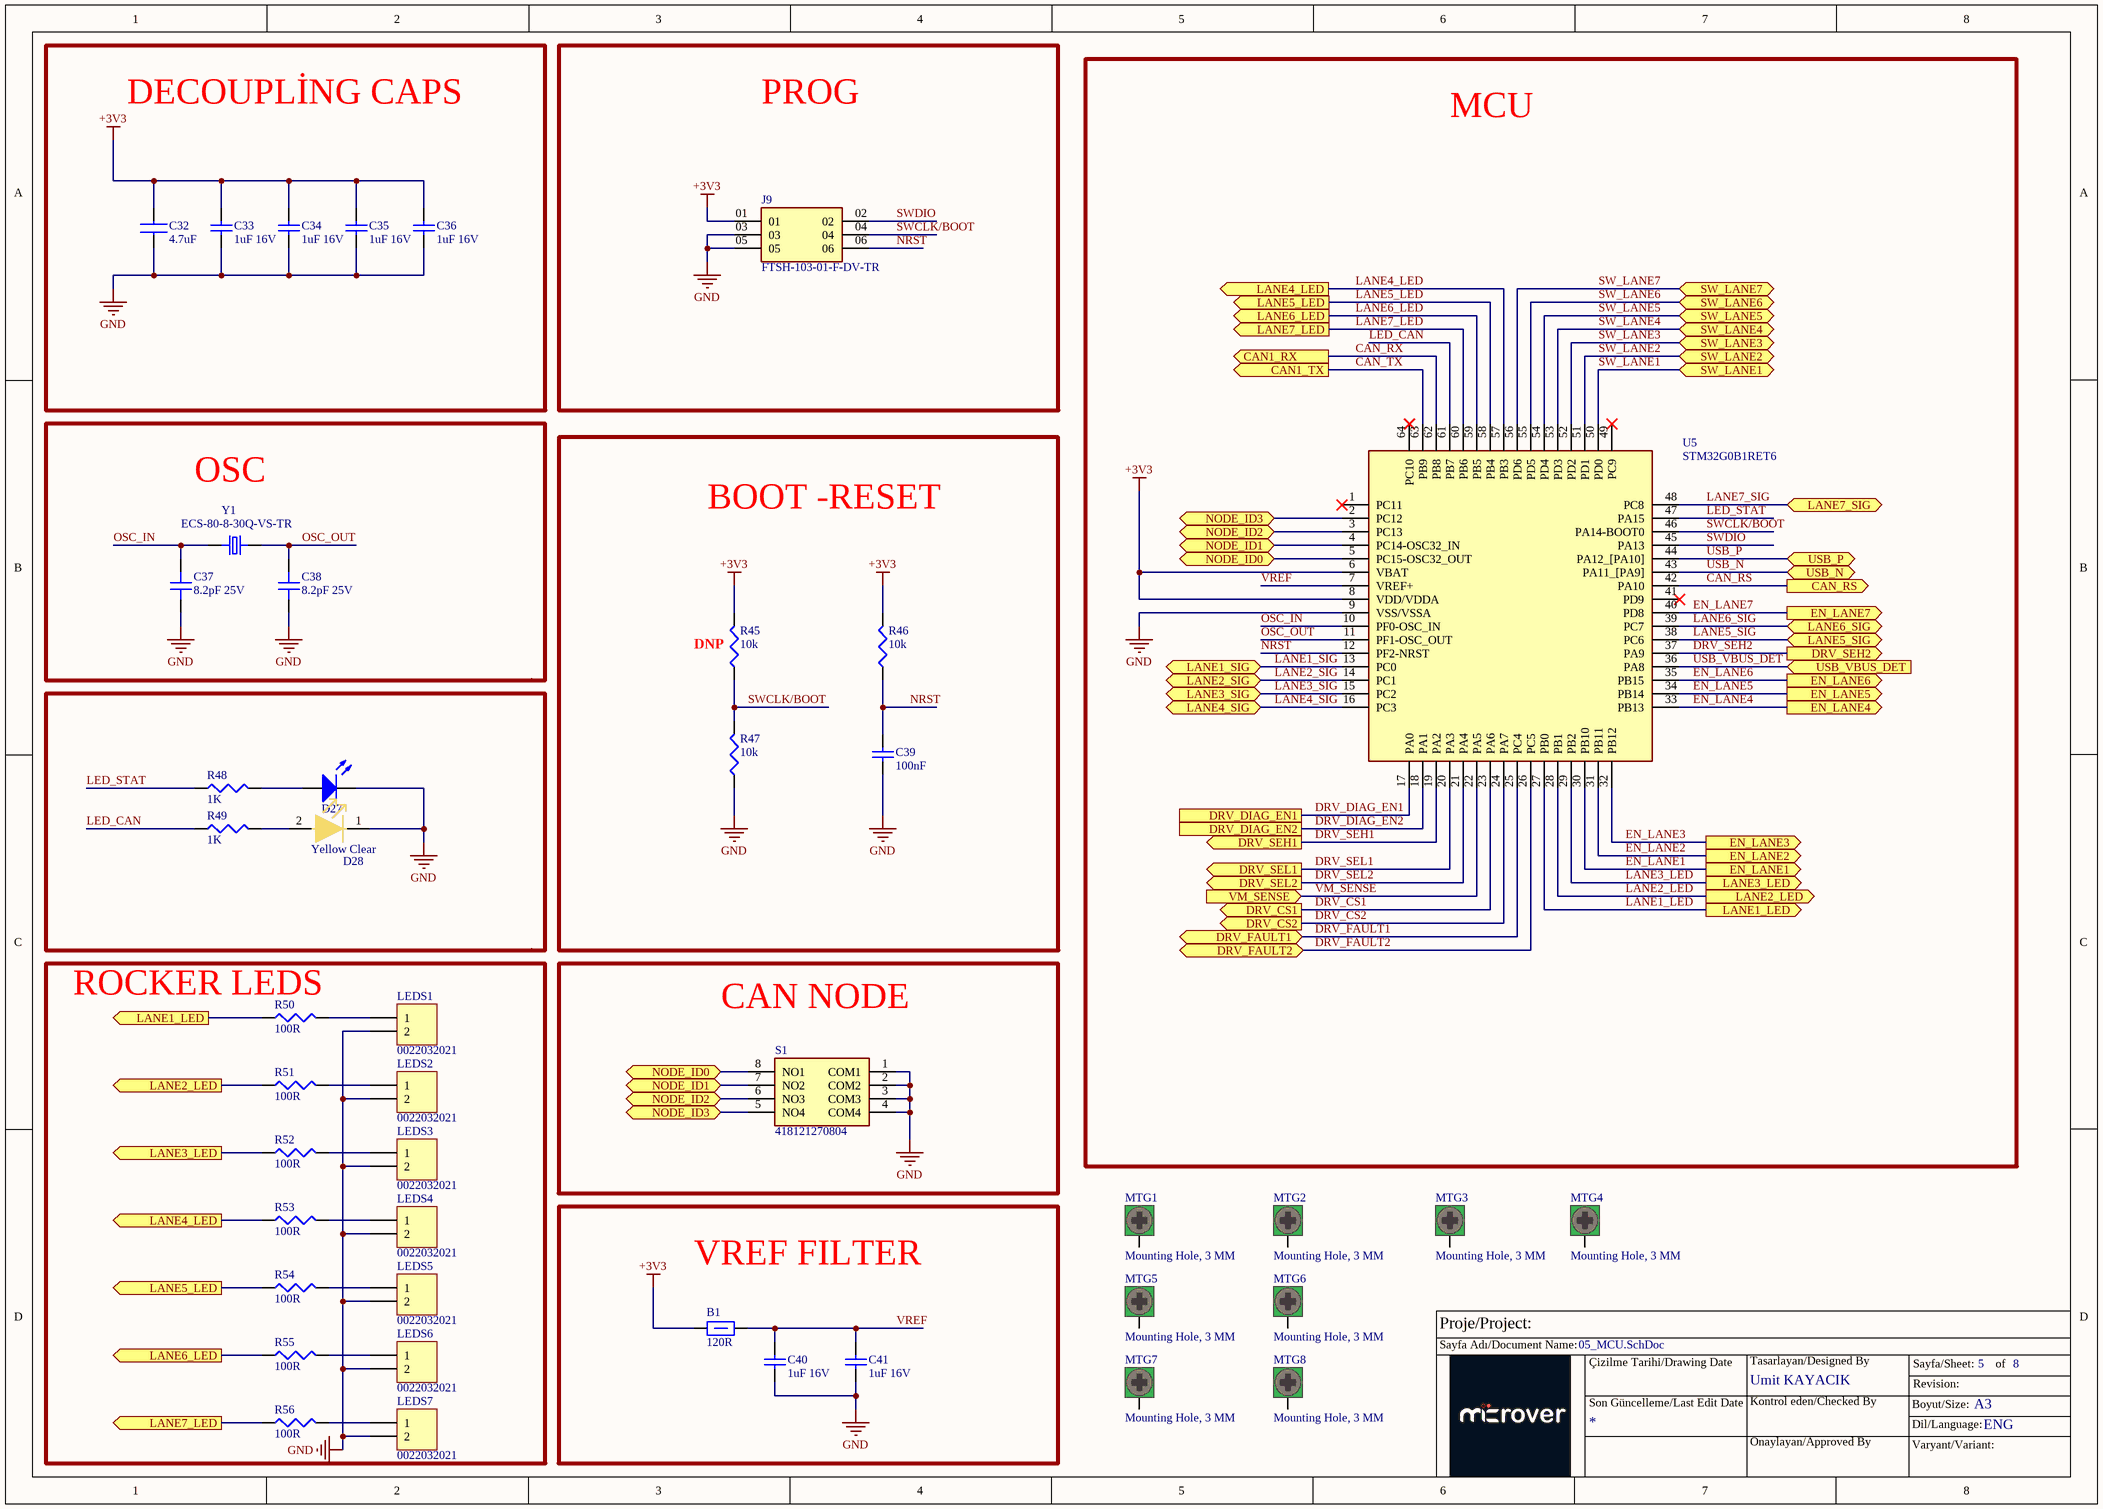
[diagram p4: 05_MCU.SchDoc]

### Parts
B1  value 120R  [F0603]  (hidden comment: BEAD FERRITE 120R 1LN SMD 0603)
C32  4.7uF  [CAP0603]
C33  value 1uF 16V  [SMC0603]  (hidden comment: CAP CER 1UF 16V X7R 0603)
C34  value 1uF 16V  [SMC0603]  (hidden comment: CAP CER 1UF 16V X7R 0603)
C35  value 1uF 16V  [SMC0603]  (hidden comment: CAP CER 1UF 16V X7R 0603)
C36  value 1uF 16V  [SMC0603]  (hidden comment: CAP CER 1UF 16V X7R 0603)
C37  8.2pF 25V  [0402_C]
C38  8.2pF 25V  [0402_C]
C39  value 100nF  [CAP0603]  (hidden comment: 100nF 25V)
C40  value 1uF 16V  [SMC0603]  (hidden comment: CAP CER 1UF 16V X7R 0603)
C41  value 1uF 16V  [SMC0603]  (hidden comment: CAP CER 1UF 16V X7R 0603)
D27  LED GREEN  [LED0805]  (value not drawn)
D28  Color: Yellow Clear  [Lite-On_Yellow_0603]  (hidden comment: LED YELLOW CLEAR SMD)
J9  FTSH-103-01-F-DV-TR  [SAMTEC_FTSH-103-01-F-DV-TR]
LEDS1  0022032021  [THD 1x2p. male straight]
LEDS2  0022032021  [THD 1x2p. male straight]
LEDS3  0022032021  [THD 1x2p. male straight]
LEDS4  0022032021  [THD 1x2p. male straight]
LEDS5  0022032021  [THD 1x2p. male straight]
LEDS6  0022032021  [THD 1x2p. male straight]
LEDS7  0022032021  [THD 1x2p. male straight]
MTG1  Mounting Hole, 3 MM  [M3 Mounting Hole]
MTG2  Mounting Hole, 3 MM  [M3 Mounting Hole]
MTG3  Mounting Hole, 3 MM  [M3 Mounting Hole]
MTG4  Mounting Hole, 3 MM  [M3 Mounting Hole]
MTG5  Mounting Hole, 3 MM  [M3 Mounting Hole]
MTG6  Mounting Hole, 3 MM  [M3 Mounting Hole]
MTG7  Mounting Hole, 3 MM  [M3 Mounting Hole]
MTG8  Mounting Hole, 3 MM  [M3 Mounting Hole]
R45  value 10k  [SMR0603]  (hidden comment: RES 10K OHM 1% 1/10W 0603)
R46  value 10k  [SMR0603]  (hidden comment: RES 10K OHM 1% 1/10W 0603)
R47  value 10k  [SMR0603]  (hidden comment: RES 10K OHM 1% 1/10W 0603)
R48  1K  [R 0603(1608)]
R49  1K  [R 0603(1608)]
R50  value 100R  [SMR0603]  (hidden comment: RES 100 OHM 1% 1/10W 0603)
R51  value 100R  [SMR0603]  (hidden comment: RES 100 OHM 1% 1/10W 0603)
R52  value 100R  [SMR0603]  (hidden comment: RES 100 OHM 1% 1/10W 0603)
R53  value 100R  [SMR0603]  (hidden comment: RES 100 OHM 1% 1/10W 0603)
R54  value 100R  [SMR0603]  (hidden comment: RES 100 OHM 1% 1/10W 0603)
R55  value 100R  [SMR0603]  (hidden comment: RES 100 OHM 1% 1/10W 0603)
R56  value 100R  [SMR0603]  (hidden comment: RES 100 OHM 1% 1/10W 0603)
S1  418121270804  [418121270804]
U5  STM32G0B1RET6  [QFP50P1200X1200X160-64N]
Y1  ECS-80-8-30Q-VS-TR  [XTAL_ECS-80-8-30Q-VS-TR]

### Blocks framed on the sheet
DECOUPLİNG CAPS: C32-C36
PROG: J9
MCU: U5
OSC: C37 C38 Y1
BOOT -RESET: C39 R45-R47
ROCKER LEDS: LEDS1-LEDS7 R50-R56
CAN NODE: S1
VREF FILTER: B1 C40 C41

### Ports
CAN1_RX (out), CAN1_TX (out), CAN_RS (out), DRV_CS1 (out), DRV_CS2 (out), DRV_DIAG_EN1, DRV_DIAG_EN2, DRV_FAULT1 (bidir), DRV_FAULT2 (bidir), DRV_SEH1 (out), DRV_SEH2 (out), DRV_SEL1 (out), DRV_SEL2 (out), EN_LANE1 (out), EN_LANE2 (out), EN_LANE3 (out), EN_LANE4 (out), EN_LANE5 (out), EN_LANE6 (out), EN_LANE7 (out), LANE1_LED (out), LANE1_SIG (bidir), LANE2_LED (out), LANE2_SIG (bidir), LANE3_LED (out), LANE3_SIG (bidir), LANE4_LED (out), LANE4_SIG (bidir), LANE5_LED (out), LANE5_SIG (bidir), LANE6_LED (out), LANE6_SIG (bidir), LANE7_LED (out), LANE7_SIG (bidir), NODE_ID0 (bidir), NODE_ID1 (bidir), NODE_ID2 (bidir), NODE_ID3 (bidir), SW_LANE1 (bidir), SW_LANE2 (bidir), SW_LANE3 (bidir), SW_LANE4 (bidir), SW_LANE5 (bidir), SW_LANE6 (bidir), SW_LANE7 (bidir), USB_N (bidir), USB_P (bidir), USB_VBUS_DET (in), VM_SENSE (in)

### Nets
+3V3: B1.1 C32.2 C33.2 C34.2 C35.2 C36.2 J9.01 R45.2 R46.2 U5.6(VBAT) U5.8(VDD/VDDA)
GND: C32.1 C33.1 C34.1 C35.1 C36.1 C37.1 C38.1 C39.1 C40.1 C41.1 D27.1(K) D28.1(C) J9.03 J9.05 LEDS1.2 LEDS2.2 LEDS3.2 LEDS4.2 LEDS5.2 LEDS6.2 LEDS7.2 R47.1 S1.1(COM1) S1.2(COM2) S1.3(COM3) S1.4(COM4) U5.9(VSS/VSSA)
CAN_RS: U5.42(PA10) ; port CAN_RS
CAN_RX: U5.62(PB8) ; port CAN1_RX
CAN_TX: U5.63(PB9) ; port CAN1_TX
DRV_CS1: U5.23(PA6) ; port DRV_CS1
DRV_CS2: U5.24(PA7) ; port DRV_CS2
DRV_DIAG_EN1: U5.17(PA0) ; port DRV_DIAG_EN1
DRV_DIAG_EN2: U5.18(PA1) ; port DRV_DIAG_EN2
DRV_FAULT1: U5.25(PC4) ; port DRV_FAULT1  [project net DRIVER_FAULT1]
DRV_FAULT2: U5.26(PC5) ; port DRV_FAULT2  [project net DRIVER_FAULT2]
DRV_SEH1: U5.19(PA2) ; port DRV_SEH1
DRV_SEH2: U5.37(PA9) ; port DRV_SEH2
DRV_SEL1: U5.20(PA3) ; port DRV_SEL1
DRV_SEL2: U5.21(PA4) ; port DRV_SEL2
EN_LANE1: U5.30(PB10) ; port EN_LANE1
EN_LANE2: U5.31(PB11) ; port EN_LANE2
EN_LANE3: U5.32(PB12) ; port EN_LANE3
EN_LANE4: U5.33(PB13) ; port EN_LANE4
EN_LANE5: U5.34(PB14) ; port EN_LANE5
EN_LANE6: U5.35(PB15) ; port EN_LANE6
EN_LANE7: U5.40(PD8) ; port EN_LANE7
LANE1_LED: R50.1 U5.27(PB0) ; port LANE1_LED
LANE1_SIG: U5.13(PC0) ; port LANE1_SIG
LANE2_LED: R51.1 U5.28(PB1) ; port LANE2_LED
LANE2_SIG: U5.14(PC1) ; port LANE2_SIG
LANE3_LED: R52.1 U5.29(PB2) ; port LANE3_LED
LANE3_SIG: U5.15(PC2) ; port LANE3_SIG
LANE4_LED: R53.1 U5.57(PB3) ; port LANE4_LED
LANE4_SIG: U5.16(PC3) ; port LANE4_SIG
LANE5_LED: R54.1 U5.58(PB4) ; port LANE5_LED
LANE5_SIG: U5.38(PC6) ; port LANE5_SIG
LANE6_LED: R55.1 U5.59(PB5) ; port LANE6_LED
LANE6_SIG: U5.39(PC7) ; port LANE6_SIG
LANE7_LED: R56.1 U5.60(PB6) ; port LANE7_LED
LANE7_SIG: U5.48(PC8) ; port LANE7_SIG
LED_CAN: R49.1 U5.61(PB7)
LED_STAT: R48.1 U5.47(PA15)
NRST: C39.2 J9.06 R46.1 U5.12(PF2-NRST)
OSC_IN: C37.2 U5.10(PF0-OSC_IN) Y1.1(IN/OUT)
OSC_OUT: C38.2 U5.11(PF1-OSC_OUT) Y1.2(OUT/IN)
SW_LANE1: U5.50(PD0) ; port SW_LANE1
SW_LANE2: U5.51(PD1) ; port SW_LANE2
SW_LANE3: U5.52(PD2) ; port SW_LANE3
SW_LANE4: U5.53(PD3) ; port SW_LANE4
SW_LANE5: U5.54(PD4) ; port SW_LANE5
SW_LANE6: U5.55(PD5) ; port SW_LANE6
SW_LANE7: U5.56(PD6) ; port SW_LANE7
SWCLK/BOOT: J9.04 R45.1 R47.2 U5.46(PA14-BOOT0)
SWDIO: J9.02 U5.45(PA13)
USB_N: U5.43(PA11_[PA9]) ; port USB_N
USB_P: U5.44(PA12_[PA10]) ; port USB_P
USB_VBUS_DET: U5.36(PA8) ; port USB_VBUS_DET
VM_SENSE: U5.22(PA5) ; port VM_SENSE
VREF: B1.2 C40.2 C41.2 U5.7(VREF+)
NetD27_2: D27.2(A) R48.2
NetD28_2: D28.2(A) R49.2
NetLEDS1_1: LEDS1.1 R50.2
NetLEDS2_1: LEDS2.1 R51.2
NetLEDS3_1: LEDS3.1 R52.2
NetLEDS4_1: LEDS4.1 R53.2
NetLEDS5_1: LEDS5.1 R54.2
NetLEDS6_1: LEDS6.1 R55.2
NetLEDS7_1: LEDS7.1 R56.2
NetS1_5: S1.5(NO4) U5.2(PC12) ; port NODE_ID3
NetS1_6: S1.6(NO3) U5.3(PC13) ; port NODE_ID2
NetS1_7: S1.7(NO2) U5.4(PC14-OSC32_IN) ; port NODE_ID1
NetS1_8: S1.8(NO1) U5.5(PC15-OSC32_OUT) ; port NODE_ID0

Not connected (* = marked no-connect by the designer): MTG1 0; MTG2 0; MTG3 0; MTG4 0; MTG5 0; MTG6 0; MTG7 0; MTG8 0; U5 1(PC11)* 41(PD9)* 49(PC9)* 64(PC10)*

### Notes on the sheet
- (near R45) DNP
- Proje/Project:
- Sayfa Adı/Document Name:
- Çizilme Tarihi/Drawing Date
- Umit KAYACIK
- Tasarlayan/Designed By
- Sayfa/Sheet:
- Revision:
- of
- Son Güncelleme/Last Edit Date
- Kontrol eden/Checked By
- Onaylayan/Approved By
- Boyut/Size:
- Varyant/Variant:
- Dil/Language:
- A3
- ENG

### Library data of the parts
B1 = BEAD FERRITE 120R 1LN SMD 0603: Manufacturer: MURATA; Manufacturer Part Name: BLM18PG121SN1D; Code: 3030007; Family: BEAD; Supplier: Digikey; Supplier No: 490-1037-2-ND; Package Reference: F1206
C32 = CAP0603_4.7uF_10V: 4.7 µF ±20% 10V Ceramic Capacitor X5R 0603 (1608 Metric); Manufacturer Name: Murata Electronics; Manufacturer Part Number: GRM185R61A475ME11D; Datasheet Link: https://componentsearchengine.com/Datasheets/1/06031A100FAT2A.pdf; Height: 0.9mm
C33-C36 C40 C41 = CAP0603_1UF_16V: 1 µF ±10% 16V Ceramic Capacitor X7R 0603 (1608 Metric); Manufacturer Part Number: CGA3E1X7R1C105K080AC; Order Code: DIGI: 445-12539-2-ND
C37 C38 = GMC04CG8R2J25NT: CAP0402 COG 8.2PF 5% 25V; Manifacturer: Cal-Chip Electronics, Inc.; Supplier: Digi; 4713-GMC04CG8R2J25NTDKR-ND
C39 = CAP0603_100nF: as C20 on sheet 04_POWER; LCSC Part Number: C1590
D27 = LED0805_GREEN: Green 570nm LED Indication - Discrete 2.1V 0805 (2012 Metric); Manufacturer Part Number: QTLP630C4TR; Manufacturer: Everlight Electronics Co Ltd; Color: Red; ComponentLink1Description: Manufacturer URL; ComponentLink2Description: Datasheet; ComponentLink1URL: http://www.we-online.com; PackageReference: 0805_A; ComponentLink2URL: http://katalog.we-online.com/led/datasheet/150080RS75000.pdf
D28 = LTST-C191KSKT: Yellow 591nm LED Indication - Discrete 2.1V 0603 (1608 Metric); Order Code: DIGI: 160-1448-2-ND; Manufacturer Part Number: LTST-C191KSKT
J9 = FTSH-103-01-F-DV-TR: Connector Header Surface Mount 6 position 0.050" (1.27mm); Manufacturer: Samtec Inc.; Supplier: SAM13919DKR-ND
LEDS1-LEDS7 = Header 2: CONN HEADER VERT 2POS 2.54MM; Manufacturer: Molex; Manufacturer Part Number: 0022032021; Supplier Part Number: WM4000-ND
MTG1-MTG8 = MTG3MM_8
R45-R47 = RES0603_10K_%1: 10 kOhms ±1% 0.1W, 1/10W Chip Resistor 0603 (1608 Metric) Moisture Resistant Thick Film; Manufacturer Part Number: RC0603FR-0710KL; Order Code: Digi: 311-10.0KHRTR-ND; Sirius Stock Code: *; LCSC Part Number: C98220; LCSC Manufacturer Part Number: RC0603FR-0710KL
R48 R49 = Res3_9: RES SMD 1K OHM 1% 1/10W 0603; Manufacturer: Yageo; Manufacturer Part Number: RC0603FR-071KL; Resistance: 1kR; Temperature Coefficient: 100ppm/°C; Power Rating: 100mW; Voltage Rating: 50V; ComponentLink1URL: https://datasheet.ciiva.com/11819/0900766b80c66297-11819477.pdf?src-supplier=RSComponents; ComponentLink1Description: https://datasheet.ciiva.com/11819/0900766b80c66297-11819477.pdf?src-supplier=RSComponents; ComponentLink2URL: https://datasheet.ciiva.com/12666/pyu-rc0402-51-rohs-l-6-r-12666741.pdf?src-supplier=Mouser; ComponentLink2Description: https://datasheet.ciiva.com/12666/pyu-rc0402-51-rohs-l-6-r-12666741.pdf?src-supplier=Mouser; ComponentLink3URL: https://datasheet.ciiva.com/17063/pyu-rc0402-51-rohs-l-6-r-17063193.pdf?src-supplier=Future+Electronics; ComponentLink3Description: https://datasheet.ciiva.com/17063/pyu-rc0402-51-rohs-l-6-r-17063193.pdf?src-supplier=Future+Electronics; ComponentLink4URL: https://datasheet.ciiva.com/22747/1018594-22747513.pdf?src-supplier=Element14; ComponentLink4Description: https://datasheet.ciiva.com/22747/1018594-22747513.pdf?src-supplier=Element14; ComponentLink5URL: https://datasheet.ciiva.com/7849/1018594-7849869.pdf?src-supplier=Element14; ComponentLink5Description: https://datasheet.ciiva.com/7849/1018594-7849869.pdf?src-supplier=Element14; ComponentLink6URL: https://datasheet.ciiva.com/7983/1018594-7983502.pdf?src-supplier=Element14; ComponentLink6Description: https://datasheet.ciiva.com/7983/1018594-7983502.pdf?src-supplier=Element14; ComponentLink7URL: https://datasheet.ciiva.com/7849/1018594-7849871.pdf?src-supplier=Element14; ComponentLink7Description: https://datasheet.ciiva.com/7849/1018594-7849871.pdf?src-supplier=Element14; ComponentLink8URL: https://datasheet.ciiva.com/11808/0900766b80c66297-11808195.pdf?src-supplier=RSComponents; ComponentLink8Description: https://datasheet.ciiva.com/11808/0900766b80c66297-11808195.pdf?src-supplier=RSComponents; ComponentLink9URL: https://datasheet.ciiva.com/2452/pyu-rc0402-51-rohs-l-6-2452608.pdf?src-supplier=Digi-Key; ComponentLink9Description: https://datasheet.ciiva.com/2452/pyu-rc0402-51-rohs-l-6-2452608.pdf?src-supplier=Digi-Key; ComponentLink10URL: https://datasheet.ciiva.com/2452/pyu-r-int-thick-7-2452609.pdf?src-supplier=Digi-Key; ComponentLink10Description: https://datasheet.ciiva.com/2452/pyu-r-int-thick-7-2452609.pdf?src-supplier=Digi-Key; ComponentLink11URL: https://datasheet.ciiva.com/2452/pyu-r-int-thick-7-2452610.pdf?src-supplier=Digi-Key; ComponentLink11Description: https://datasheet.ciiva.com/2452/pyu-r-int-thick-7-2452610.pdf?src-supplier=Digi-Key; ComponentLink12URL: https://datasheet.ciiva.com/28386/pyu-rc0402-51-rohs-l-6-28386633.pdf?src-supplier=Avnet+Europe; ComponentLink12Description: https://datasheet.ciiva.com/28386/pyu-rc0402-51-rohs-l-6-28386633.pdf?src-supplier=Avnet+Europe; ComponentLink13URL: https://datasheet.ciiva.com/22747/1018594-22747515.pdf?src-supplier=Element14; ComponentLink13Description: https://datasheet.ciiva.com/22747/1018594-22747515.pdf?src-supplier=Element14; ComponentLink14URL: https://datasheet.ciiva.com/7983/1018594-7983535.pdf?src-supplier=Element14; ComponentLink14Description: https://datasheet.ciiva.com/7983/1018594-7983535.pdf?src-supplier=Element14; ComponentLink15URL: https://datasheet.ciiva.com/8896/pyu-rc0402-51-rohs-l-6-8896201.pdf?src-supplier=Avnet; ComponentLink15Description: https://datasheet.ciiva.com/8896/pyu-rc0402-51-rohs-l-6-8896201.pdf?src-supplier=Avnet; ComponentLink16URL: https://datasheet.ciiva.com/15189/getdatasheetpartid-326379-15189533.pdf?src-supplier=Verical; ComponentLink16Description: https://datasheet.ciiva.com/15189/getdatasheetpartid-326379-15189533.pdf?src-supplier=Verical; Supplier 1: Digi-Key; Supplier Part Number 1: 311-1.00KHRCT-ND; RoHS: Yes; Category: Chip SMD Resistors; Stock 1: 11977983; Pricing 1: 1=0,10000, 10=0,02400, 100=0,00970, 1000=0,00436, 2500=0,00378 (USD); Case/Package: 0603; Contact Plating: Tin,Matte; Case Code (Imperial): 0603; Case Code (Metric): 1608; Size Code: 0603; Min Operating Temperature: -55°C; Max Operating Temperature: 155°C; Tolerance: 1%; Resistor Type: Thick Film; Packaging: Tape and Reel; Termination: SMD/SMT; Features: Moisture Resistant; Series: RC; Max Power Dissipation: 100mW; Number of Terminations: 2; Technology: THICK FILM; Resistance Tolerance: 1%; Construction: Rectangular; Length: 1.6mm; Height: 0.45mm; Depth: 0.8mm; Radiation Hardening: No; REACH SVHC: No SVHC; Lead Free: Lead Free; Military Standard: Not; RoHS Compliant: Yes
R50-R56 = RES0603_100R_%1_1: 100 Ohms ±1% 0.1W, 1/10W Chip Resistor 0603 (1608 Metric) Moisture Resistant Thick Film; Manufacturer Part Number: RC0603FR-07100RL; Order Code: Digi: 311-100HRTR-ND; Sirius Stock Code: *; LCSC Part Number: C105588; LCSC Manufacturer Part Number: RC0603FR-07100RL
S1 = 418121270804: Dip Switch, 0.025A, 24Vdc, 4 Pos, Smd Rohs Compliant: Yes |Wurth Elektronik 418121270804; Manufacturer: Wurth Electronics; Supplier 1: Digikey; Manufacturer Part Number: 418121270804; RoHS: Yes; Category: DIP Switches; Stock 1: 5600; Pricing 1: 800=1.456 (USD); ComponentLink1URL: https://katalog.we-online.de/em/datasheet/4181212708xx.pdf?src-supplier=Digikey; ComponentLink1Description: https://katalog.we-online.de/em/datasheet/4181212708xx.pdf?src-supplier=Digikey; Supplier Part Number 1: 732-6963-2-ND
U5 = STM32G0B1RET6: ARM® Cortex®-M0+ STM32G0 Microcontroller IC 32-Bit 64MHz 512KB (512K x 8) FLASH 64-LQFP (10x10); Supplier: 497-STM32G0B1RET6-ND; MPN: STM32G0B1RET6
Y1 = ECS-80-8-30Q-VS-TR: CRYSTAL 8.0000MHZ 8PF SMD; Manufacturer: ESC Inc.; Supplier: Digi; XC3144DKR-ND

## Sheet 06_CANBUS.SchDoc: =TitleParameter
size A3; Organization: ASISGUARD; Address1: Kemalpasa, Kemalpasa Cd. No:290 D:292H, 35060 Bornova/Izmir/Turkey; Revision: R1; SheetNumber: 6; SheetTotal: 8
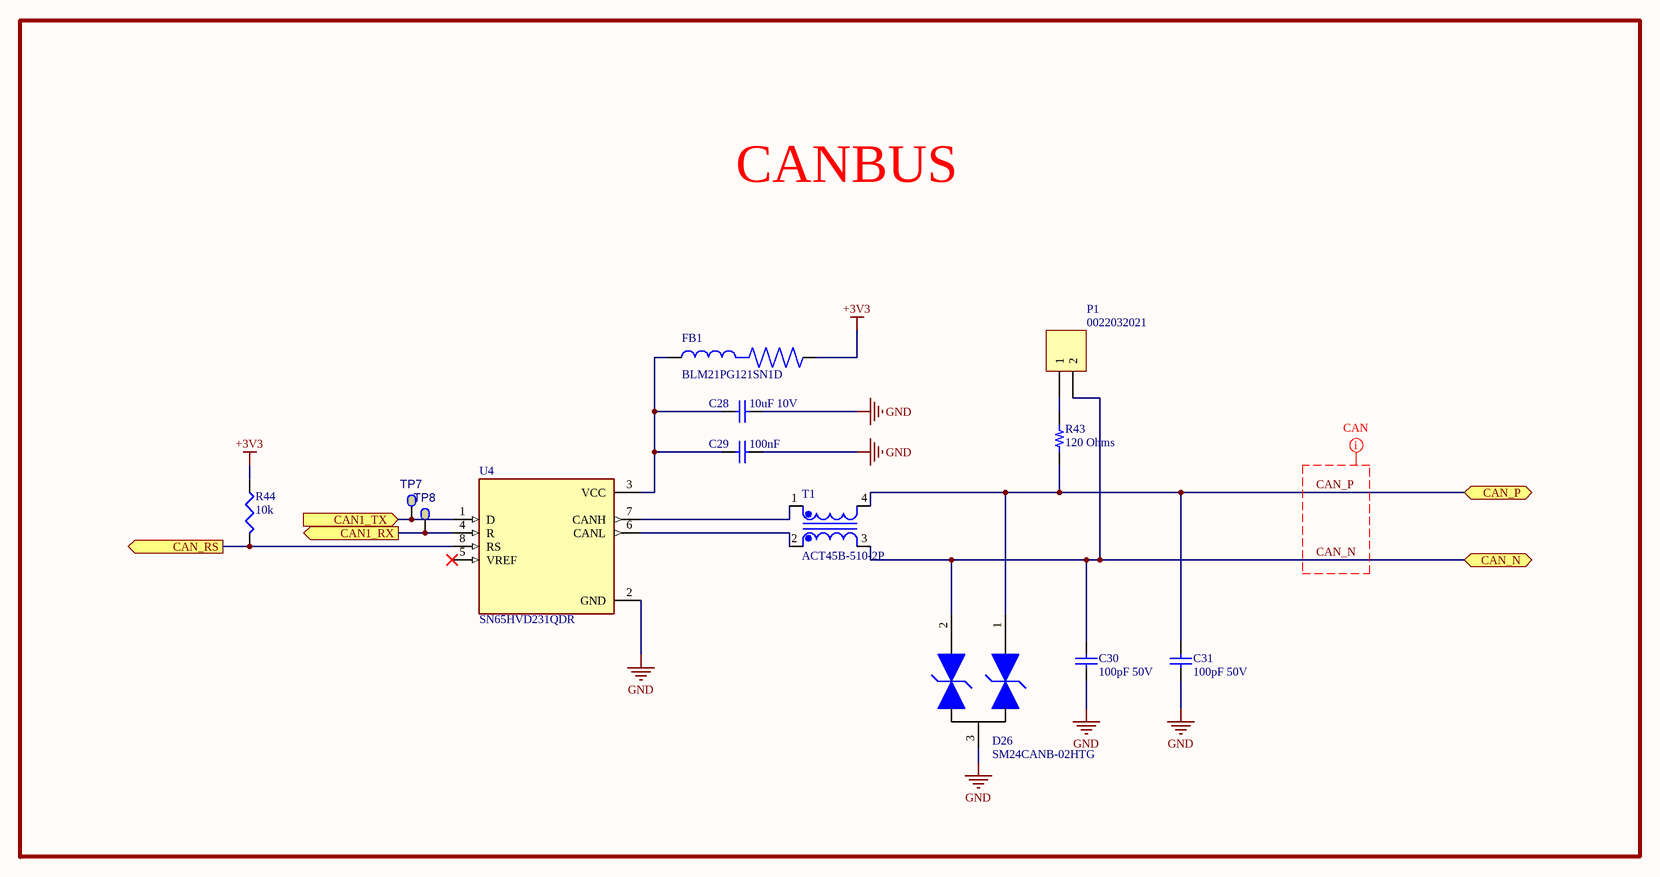
[diagram p5: 06_CANBUS.SchDoc]

### Parts
C28  value 10uF 10V  [SMC0603]  (hidden comment: CAP CER 10UF 10V X5R 0603)
C29  100nF  [CAP0603]
C30  value 100pF 50V  [CAP0603]  (hidden comment: CAP CER 100PF 50V C0G/NP0 0603)
C31  value 100pF 50V  [CAP0603]  (hidden comment: CAP CER 100PF 50V C0G/NP0 0603)
D26  Manufacturer Part Number: SM24CANB-02HTG  [SOT23_3-DIODE]  (hidden comment: CAN)
FB1  BLM21PG121SN1D  [BEADC2012X105N/]
P1  0022032021  [THD 1x2p. male straight]
R43  120 Ohms  [RES 1206_3216]
R44  value 10k  [RES0603]  (hidden comment: RES 10K OHM 1% 1/8W 0603)
T1  ACT45B-510-2P  [TDK_ACT45B-510-2P-TL003_0]
TP7  Testpoint  [SMD_Ø1.5mm]  (value not drawn)  (no BOM)
TP8  Testpoint  [SMD_Ø1.5mm]  (value not drawn)  (no BOM)
U4  SN65HVD231QDR  [SOIC127P599X175-8N/]

### Blocks framed on the sheet
CANBUS: C28-C31 D26 FB1 P1 R43 R44 T1 TP7 TP8 U4

### Ports
CAN1_RX (out), CAN1_TX (in), CAN_N (bidir), CAN_P (bidir), CAN_RS (out)

### Nets
+3V3: FB1.2 R44.1
GND: C28.1 C29.1 C30.1 C31.1 D26.3 U4.2(GND)
CAN_N: C30.2 D26.2 P1.2 T1.3 ; port CAN_N
CAN_P: C31.2 D26.1 R43.1 T1.4 ; port CAN_P
CAN_RS: R44.2 U4.8(RS) ; port CAN_RS
CAN_RX: TP8.1(P1) U4.4(R) ; port CAN1_RX
CAN_TX: TP7.1(P1) U4.1(D) ; port CAN1_TX
NetC28_2: C28.2 C29.2 FB1.1 U4.3(VCC)
NetP1_1: P1.1 R43.2
NetT1_1: T1.1 U4.7(CANH)
NetT1_2: T1.2 U4.6(CANL)

Not connected (* = marked no-connect by the designer): U4 5(VREF)*

### Layout directives
net class CAN: CAN_N, CAN_P

### Notes on the sheet
- Proje/Project:
- Sayfa Adı/Document Name:
- Çizilme Tarihi/Drawing Date
- Umit KAYACIK
- Tasarlayan/Designed By
- Sayfa/Sheet:
- Revision:
- of
- Son Güncelleme/Last Edit Date
- Kontrol eden/Checked By
- Onaylayan/Approved By
- Boyut/Size:
- Varyant/Variant:
- Dil/Language:
- A3
- ENG

### Library data of the parts
C28 = CAP0603_10UF_10V: 10 µF ±10% 10V Ceramic Capacitor X5R 0603 (1608 Metric); Manufacturer Part Number: CL10A106KP8NNNC; Order Code: DIGI: 1276-1192-2-ND; Sirius Stock Code: *; LCSC Part Number: C19702; LCSC Manufacturer Part Number: CL10A106KP8NNNC
C29 = CAP0603_100nF_50V: as C1 on sheet 03_CONNECTOR; Datasheet Link: https://componentsearchengine.com/Datasheets/1/06031A100FAT2A.pdf; Height: 0.9mm
C30 C31 = CAP0603_100PF: 100 pF ±5% 50V Ceramic Capacitor C0G, NP0 0603 (1608 Metric); Manufacturer Part Number: CL10C101JB8NNNC; LCSC Part Number: C14858
D26 = SM24CANB-02HTG_TVS: TVS DIODE 24VWM 50VC SOT23-3; Order Code: DIGI : F6707CT-ND; Value: 2Ch; LCSC Manufacturer Part Number: SM24CANB-02HTG; LCSC Part Number: C151237
FB1 = BLM21PG121SN1D: 120 Ohms @ 100 MHz 1 Power Line Ferrite Bead 0805 (2012 Metric) 3A 30mOhm; MPN: BLM21PG121SN1D; Supplier: Digi; 490-5986-6-ND
P1 = Header 2: as LEDS1 on sheet 05_MCU; Manufacturer Part Number: 0022032021; Supplier Part Number: WM4000-ND
R43 = AC1206FR-07120RL: RES SMD 120 OHM 1% 1/4W 1206; Manufacturer: Yageo; Power (Watts): 0.25W, 1/4W; Temperature Coefficient: ±100ppm/°C; Part Number: AC1206FR-07120RL; ComponentLink1Description: Datasheet; ComponentLink1URL: https://www.yageo.com/upload/media/product/productsearch/datasheet/rchip/PYu-AC_51_RoHS_L_7.pdf; ComponentLink2Description: DigiKey Link; ComponentLink2URL: https://www.digikey.com/en/products/detail/yageo/AC1206FR-07120RL/5897228; Composition: Thick Film; Device Package: 1206 (3216 Metric); Features: Automotive AEC-Q200, Moisture Resistant; Height - Seated (Max): 0.026" (0.65mm); LastUpdated: 2/9/2024 8:54:27 PM; Lifecycle Status: Active; Minimum Order: 1; Number of Terminations: 2; Operating Temperature: -55°C ~ 155°C; Package / Case: 1206 (3216 Metric); Packaging: TapeAndReel; PartId: 31141; Part Status: Active; Price: 0.01; Ratings: AEC-Q200; Resistance: 120 Ohms; Series: AC; Size / Dimension: 0.122" L x 0.063" W (3.10mm x 1.60mm); Supplier 1: DigiKey; Supplier Part Number 1: YAG3810CT-ND; Supplier Device Package: 1206; Tolerance: ±1%; Value: 120 Ohms
R44 = RES0603_10K_%1_1: as R37 on sheet 04_POWER; Sirius Stock Code: *; LCSC Part Number: C161803
T1 = ACT45B-510-2P: Ind Common Mode Filter Wirewound 51uH 2KOhm -30% to 50% 100KHz 200mA 1812 T/R; Manufacturer: TDK; Manufacturer Part Number: ACT45B-510-2P-TL003; Core Material: Ferrite; Impedance: 2.8kR; DC Resistance (DCR): 1R; Number of Lines: 2; Voltage Rating (DC): 50V; Test Frequency: 10MHz; Insulation Resistance: 10MR; Element Configuration: Dual; Supplier 1: Digi-Key; Supplier Part Number 1: 445-3958-1-ND; RoHS: Yes; Category: Fixed Inductors; Stock 1: 75821; Pricing 1: 1=1,95000, 10=1,80000, 25=1,65000, 50=1,41000, 100=1,26000, 250=1,08000, 500=1,02000, 1000=0,93000 (USD); Mount: Surface Mount; Case/Package: 1812; Number of Pins: 4; Case Code (Imperial): 1812; Min Operating Temperature: -40°C; Max Operating Temperature: 150°C; Inductance: 51uH; Packaging: Tape and Reel; Package Quantity: 2000; Tolerance: 50%; Current Rating: 200mA; Max DC Current: 200mA; Current: 200mA; Voltage Rating: 50V; Termination: SMD/SMT; DC Current: 200mA; Self Resonant Frequency: 10MHz; Length: 4.7mm; Width: 3.2mm; Height: 2.8mm; Depth: 3.4mm; Radiation Hardening: No; REACH SVHC: No SVHC; Lead Free: Lead Free; Military Standard: Not; ComponentLink1URL: https://datasheet.ciiva.com/22726/1649098-22726290.pdf?src-supplier=Element14; ComponentLink1Description: https://datasheet.ciiva.com/22726/1649098-22726290.pdf?src-supplier=Element14; ComponentLink2URL: https://datasheet.ciiva.com/26793/act45b-510-2p-tl003-26793344.pdf?src-supplier=IIIC; ComponentLink2Description: https://datasheet.ciiva.com/26793/act45b-510-2p-tl003-26793344.pdf?src-supplier=IIIC; ComponentLink3URL: https://datasheet.ciiva.com/8498/e9711-act-8498633.pdf?src-supplier=Avnet; ComponentLink3Description: https://datasheet.ciiva.com/8498/e9711-act-8498633.pdf?src-supplier=Avnet; ComponentLink4URL: https://datasheet.ciiva.com/1007/e9711-act-1007931.pdf?src-supplier=Digi-Key; ComponentLink4Description: https://datasheet.ciiva.com/1007/e9711-act-1007931.pdf?src-supplier=Digi-Key; ComponentLink5URL: https://datasheet.ciiva.com/15191/getdatasheetpartid-349822-15191803.pdf?src-supplier=Verical; ComponentLink5Description: https://datasheet.ciiva.com/15191/getdatasheetpartid-349822-15191803.pdf?src-supplier=Verical; ComponentLink6URL: https://datasheet.ciiva.com/1007/e9711-act-1007932.pdf?src-supplier=Digi-Key; ComponentLink6Description: https://datasheet.ciiva.com/1007/e9711-act-1007932.pdf?src-supplier=Digi-Key; ComponentLink7URL: https://datasheet.ciiva.com/1007/e9711-act-1007933.pdf?src-supplier=Digi-Key; ComponentLink7Description: https://datasheet.ciiva.com/1007/e9711-act-1007933.pdf?src-supplier=Digi-Key; ComponentLink8URL: https://datasheet.ciiva.com/7649/1833202-7649183.pdf?src-supplier=Element14; ComponentLink8Description: https://datasheet.ciiva.com/7649/1833202-7649183.pdf?src-supplier=Element14; LCSC Manufacturer Part Number: ACT45B-510-2P-TL003; LCSC Part Number: C76584
TP7 TP8 = TEST PAD SMT 10MIL X 20MIL: DNP: DNP; Value: Testpoint
U4 = SN65HVD231QDR: 3.3-V CAN Transceiver with Sleep Mode; MPN: SN65HVD231QDR; Supplier: Digi; 296-48950-6-ND

## Sheet 07_USB.SchDoc: =TitleParameter
size A3; Organization: ASISGUARD; Address1: Kemalpasa, Kemalpasa Cd. No:290 D:292H, 35060 Bornova/Izmir/Turkey; Revision: R1; SheetNumber: 7; SheetTotal: 8
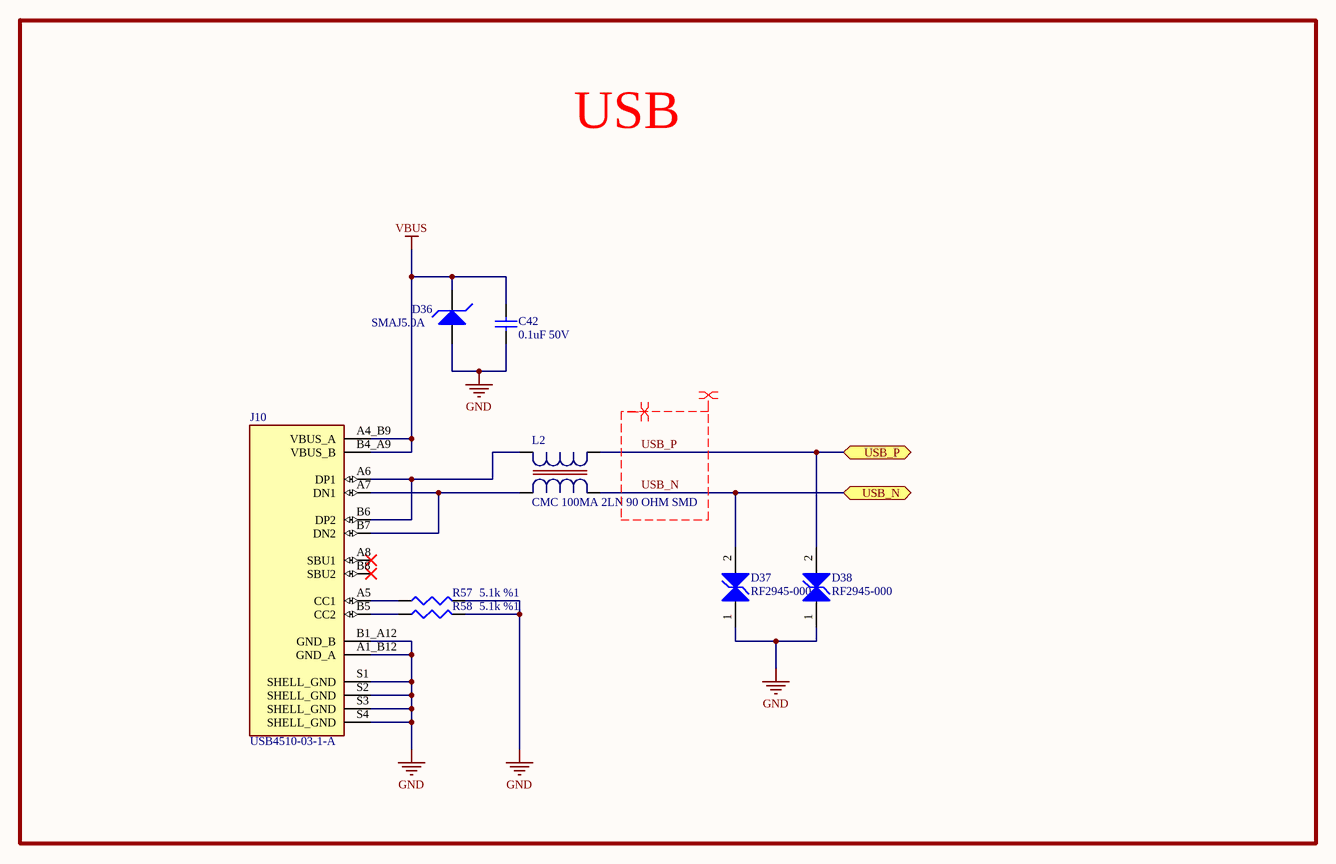
[diagram p6: 07_USB.SchDoc]

### Parts
C42  value 0.1uF 50V  [SMC0402]  (hidden comment: CAP CER 0.1UF 50V X7R 0402)
D36  SMAJ5.0A  [SMAJ5.0A]
D37  value RF2945-000  [Littelfuse_SESD0402_MFG]  (hidden comment: TVS DIODE 7VWM 10VC 0402)
D38  value RF2945-000  [Littelfuse_SESD0402_MFG]  (hidden comment: TVS DIODE 7VWM 10VC 0402)
J10  Manufacturer Part Number: USB4510-03-1-A  [GCT_USB4510-03-1-A_REVA]  (hidden comment: USB C REC 16P 3U" MID MNT 1.6MM)
L2  CMC 100MA 2LN 90 OHM SMD  [IND_MCZ1210AH_TDK]
R57  value 5.1k %1  [SMR0402]  (hidden comment: RES SMD 5.1K OHM 1% 1/16W 0402)
R58  value 5.1k %1  [SMR0402]  (hidden comment: RES SMD 5.1K OHM 1% 1/16W 0402)

### Blocks framed on the sheet
USB: C42 D36-D38 J10 L2 R57 R58

### Ports
USB_N (bidir), USB_P (bidir)

### Nets
GND: C42.1 D36.1(A) D37.1 D38.1 J10.A1_B12(GND_A) J10.B1_A12(GND_B) J10.S1(SHELL_GND) J10.S2(SHELL_GND) J10.S3(SHELL_GND) J10.S4(SHELL_GND) R57.2 R58.2
VBUS: C42.2 D36.2(K) J10.A4_B9(VBUS_A) J10.B4_A9(VBUS_B)
USB_N: D37.2 L2.3 ; port USB_N
USB_P: D38.2 L2.4 ; port USB_P
NetJ10_A5: J10.A5(CC1) R57.1
NetJ10_A6: J10.A6(DP1) J10.B6(DP2) L2.1
NetJ10_A7: J10.A7(DN1) J10.B7(DN2) L2.2
NetJ10_B5: J10.B5(CC2) R58.1

Not connected (* = marked no-connect by the designer): J10 A8(SBU1)* B8(SBU2)*

### Layout directives
differential pair; differential pair class DIFF_USB: USB_N, USB_P
net class USB: USB_N, USB_P

### Notes on the sheet
- Proje/Project:
- Sayfa Adı/Document Name:
- Çizilme Tarihi/Drawing Date
- Umit KAYACIK
- Tasarlayan/Designed By
- Sayfa/Sheet:
- Revision:
- of
- Son Güncelleme/Last Edit Date
- Kontrol eden/Checked By
- Onaylayan/Approved By
- Boyut/Size:
- Varyant/Variant:
- Dil/Language:
- A3
- ENG

### Library data of the parts
C42 = CAP0402_0.1UF_50V_1: 0.1 µF ±10% 50V Ceramic Capacitor X7R 0402 (1005 Metric); Manufacturer Part Number: GCM155R71H104KE02J; Order Code: DIGI: 490-14514-2-ND
D36 = SMAJ5.0A: 9.2V Clamp 43.5A Ipp Tvs Diode Surface Mount DO-214AC (SMA); Manufacturer: Littelfuse Inc.; MPN: SMAJ5.0A
D37 D38 = RF2945-000: 10V (Typ) Clamp 2A (8/20µs) Ipp Tvs Diode Surface Mount 0402; Manufacturer Part Number: SESD0402X1BN-0010-098; Order Code: DIGI: SESD0402X1BN-0010-098TR-ND
J10 = USB4510-03-1-A_REVA: USB-C (USB TYPE-C) USB 2.0 Receptacle Connector 24 (16+8 Dummy) Position Board Edge, Cutout; Surface Mount; Through Hole, Right Angle; Order Code: DIGI: 2073-USB4510-03-1-ATR-ND
L2 = MCZ1210AH900L2T: 2 Line Common Mode Choke Surface Mount 90 Ohms @ 100 MHz 100mA DCR 1.75Ohm; Manufacturer Part Number: MCZ1210AH900L2TA0G; LCSC Manufacturer Part Number: MCZ1210AH900L2TD0G; Order Code: Digi: 445-MCZ1210AH900L2TA0GTR-ND; LCSC Part Number: C435268
R57 R58 = RES0402_5.1K_%1: 5.1 kOhms ±1% 0.063W, 1/16W Chip Resistor 0402 (1005 Metric) Automotive AEC-Q200 Thick Film; Manufacturer Part Number: CRCW04025K10FKED; Order Code: DIGI: 541-5.10KLTR-ND